# EAGLE schematic PCB_ICBExt-R1.0-J23 (EAGLE 6.6.0)
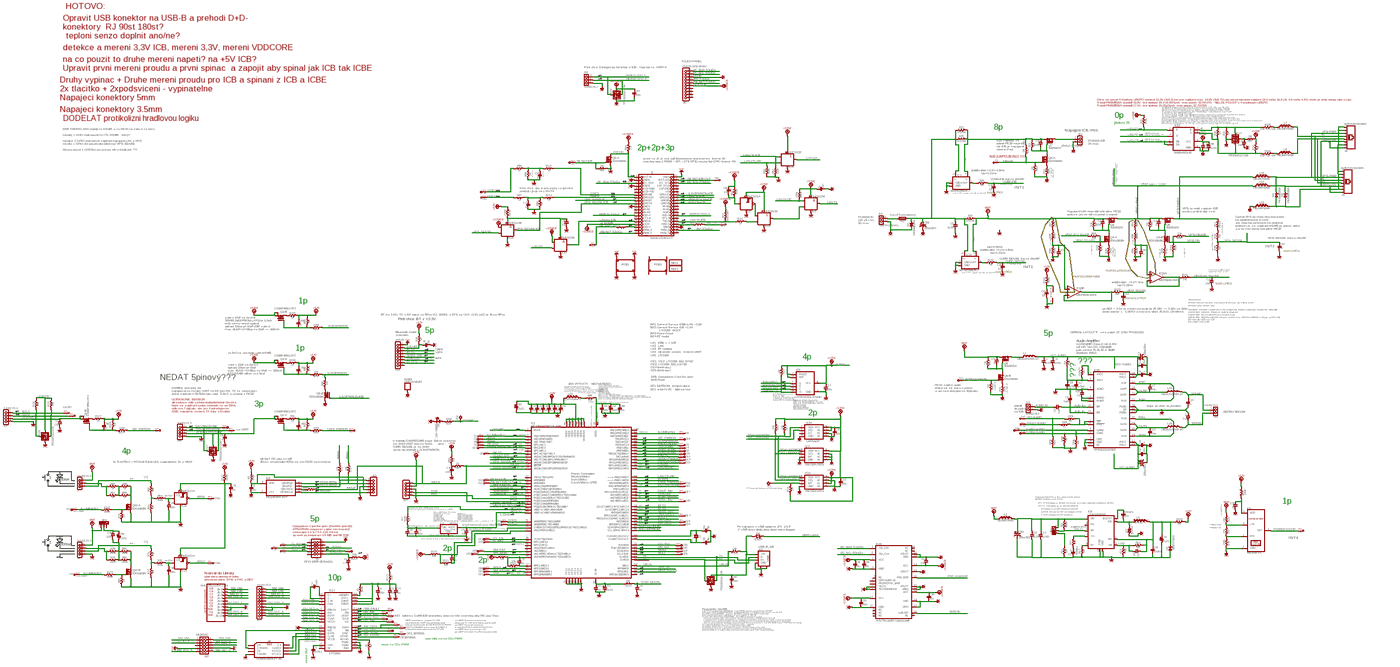
[diagram p0: schematic, sheet 1, overview]
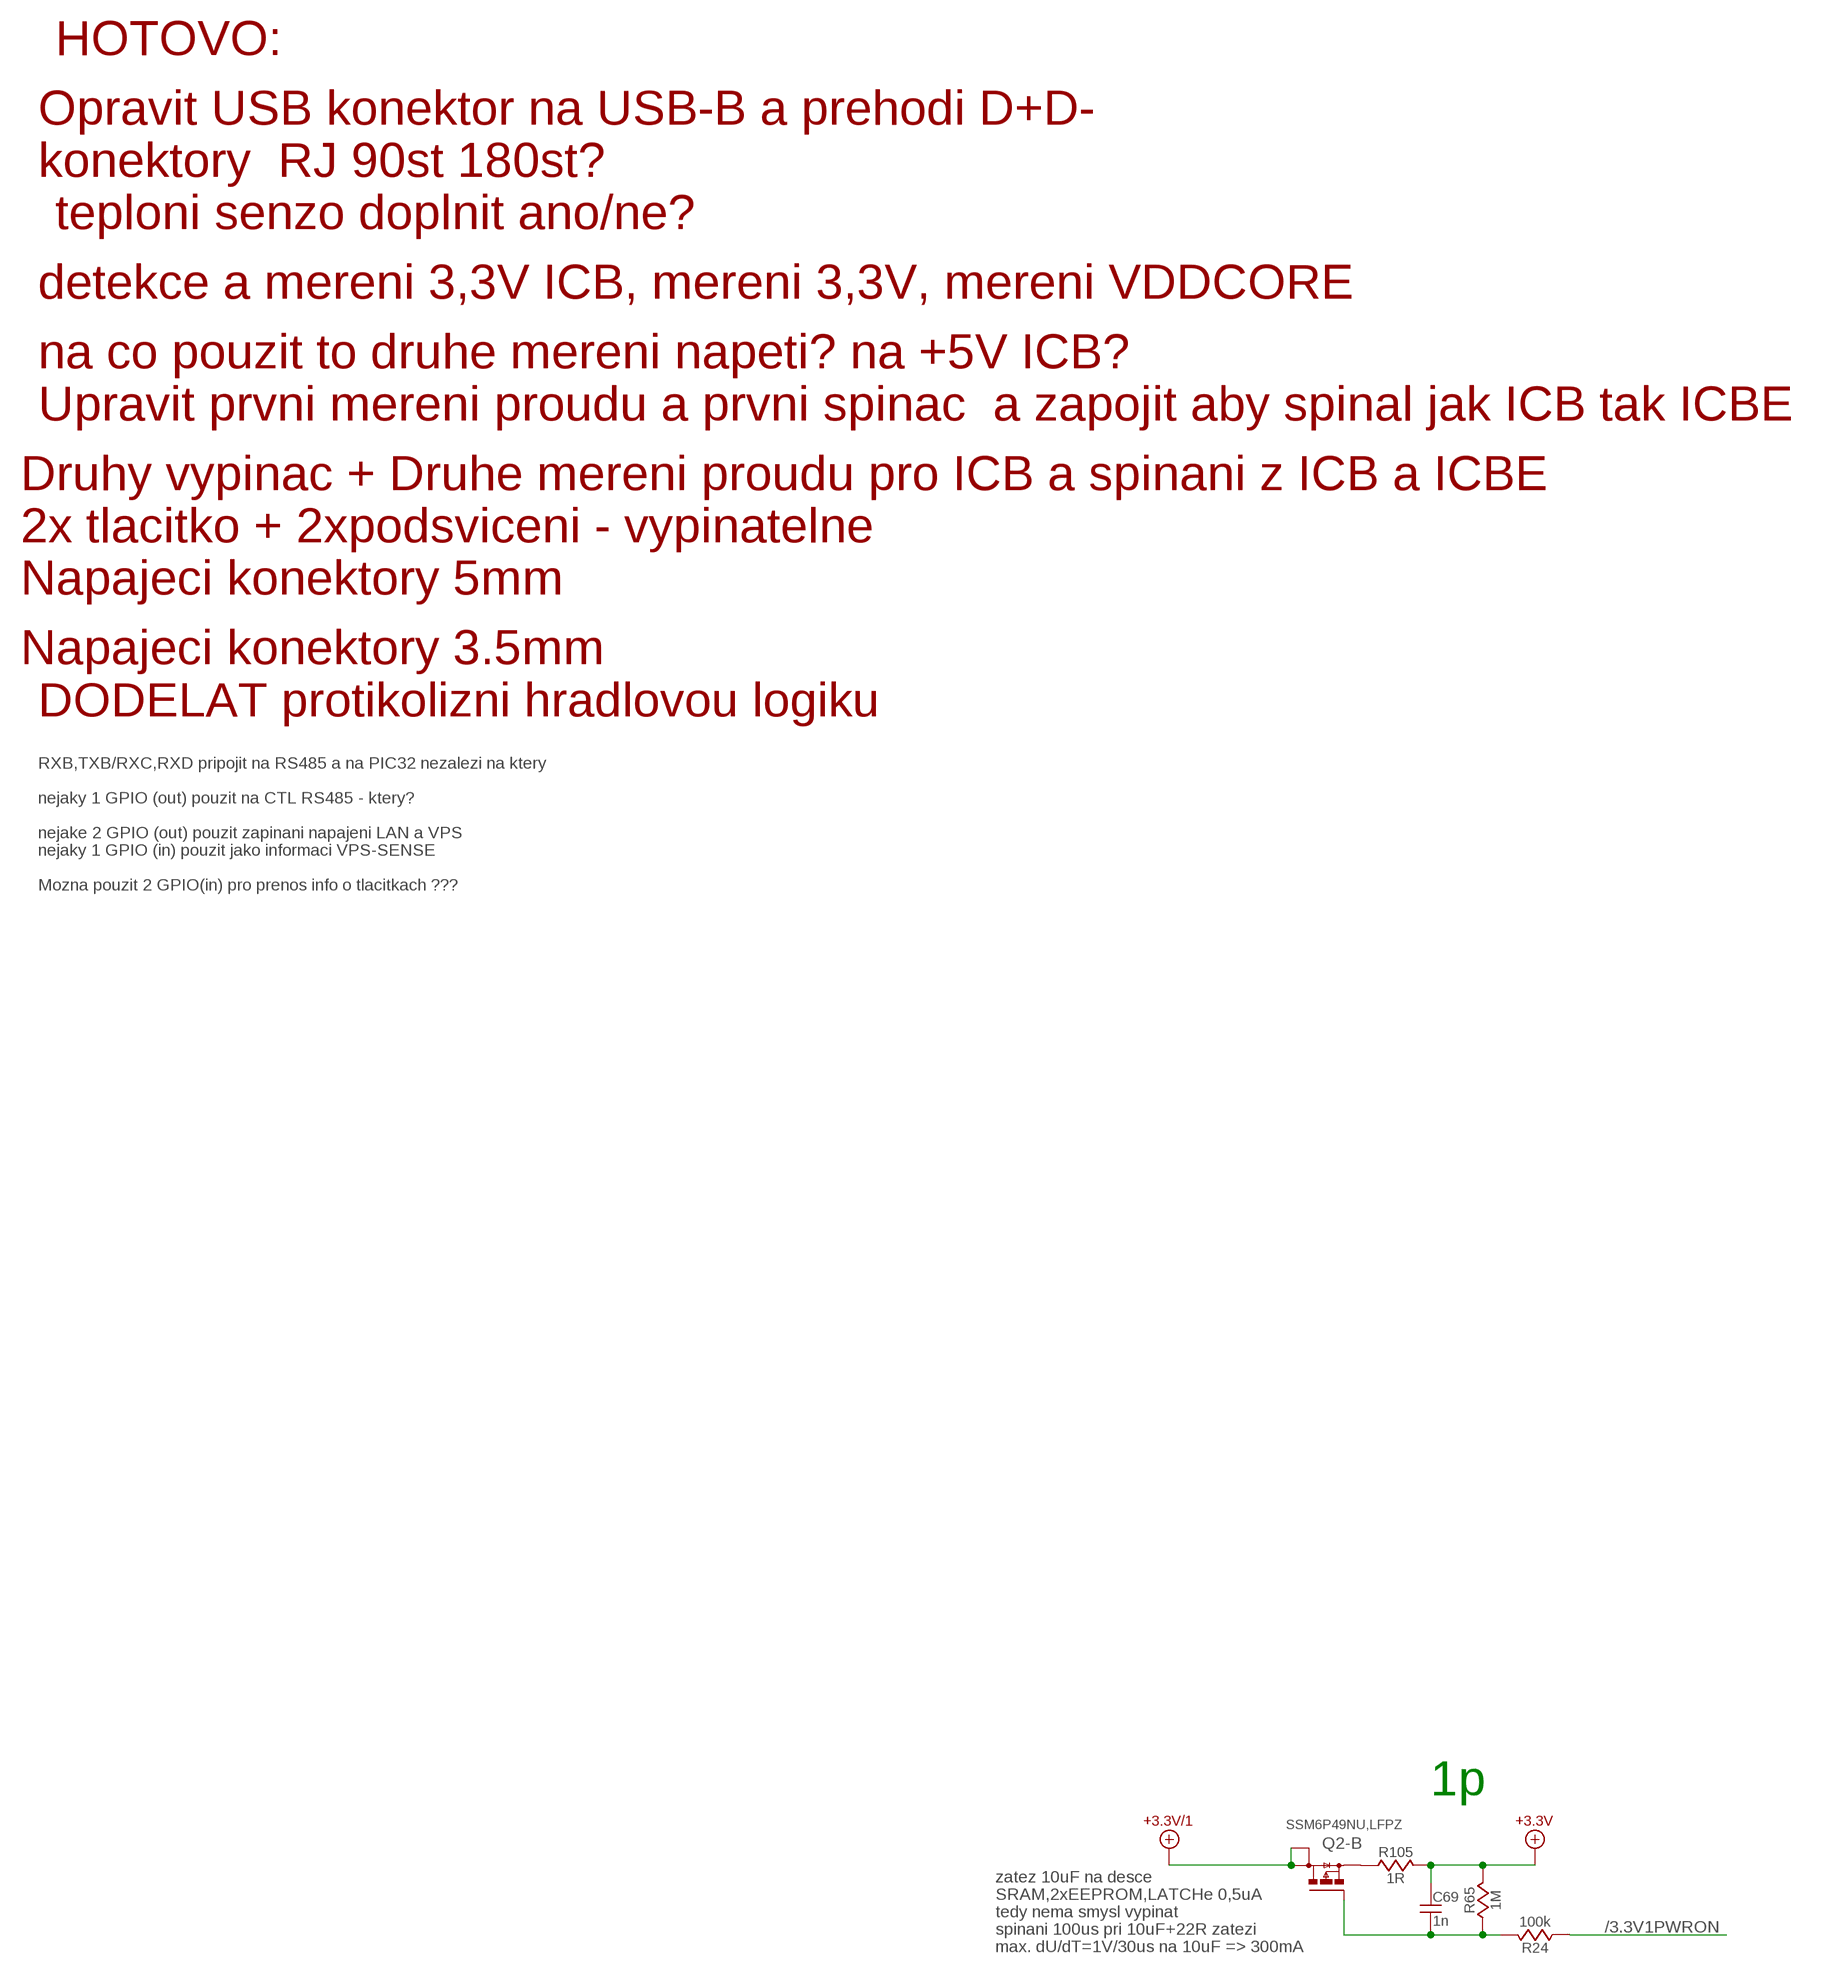
[diagram p1: schematic, sheet 1, part 1 of 6]
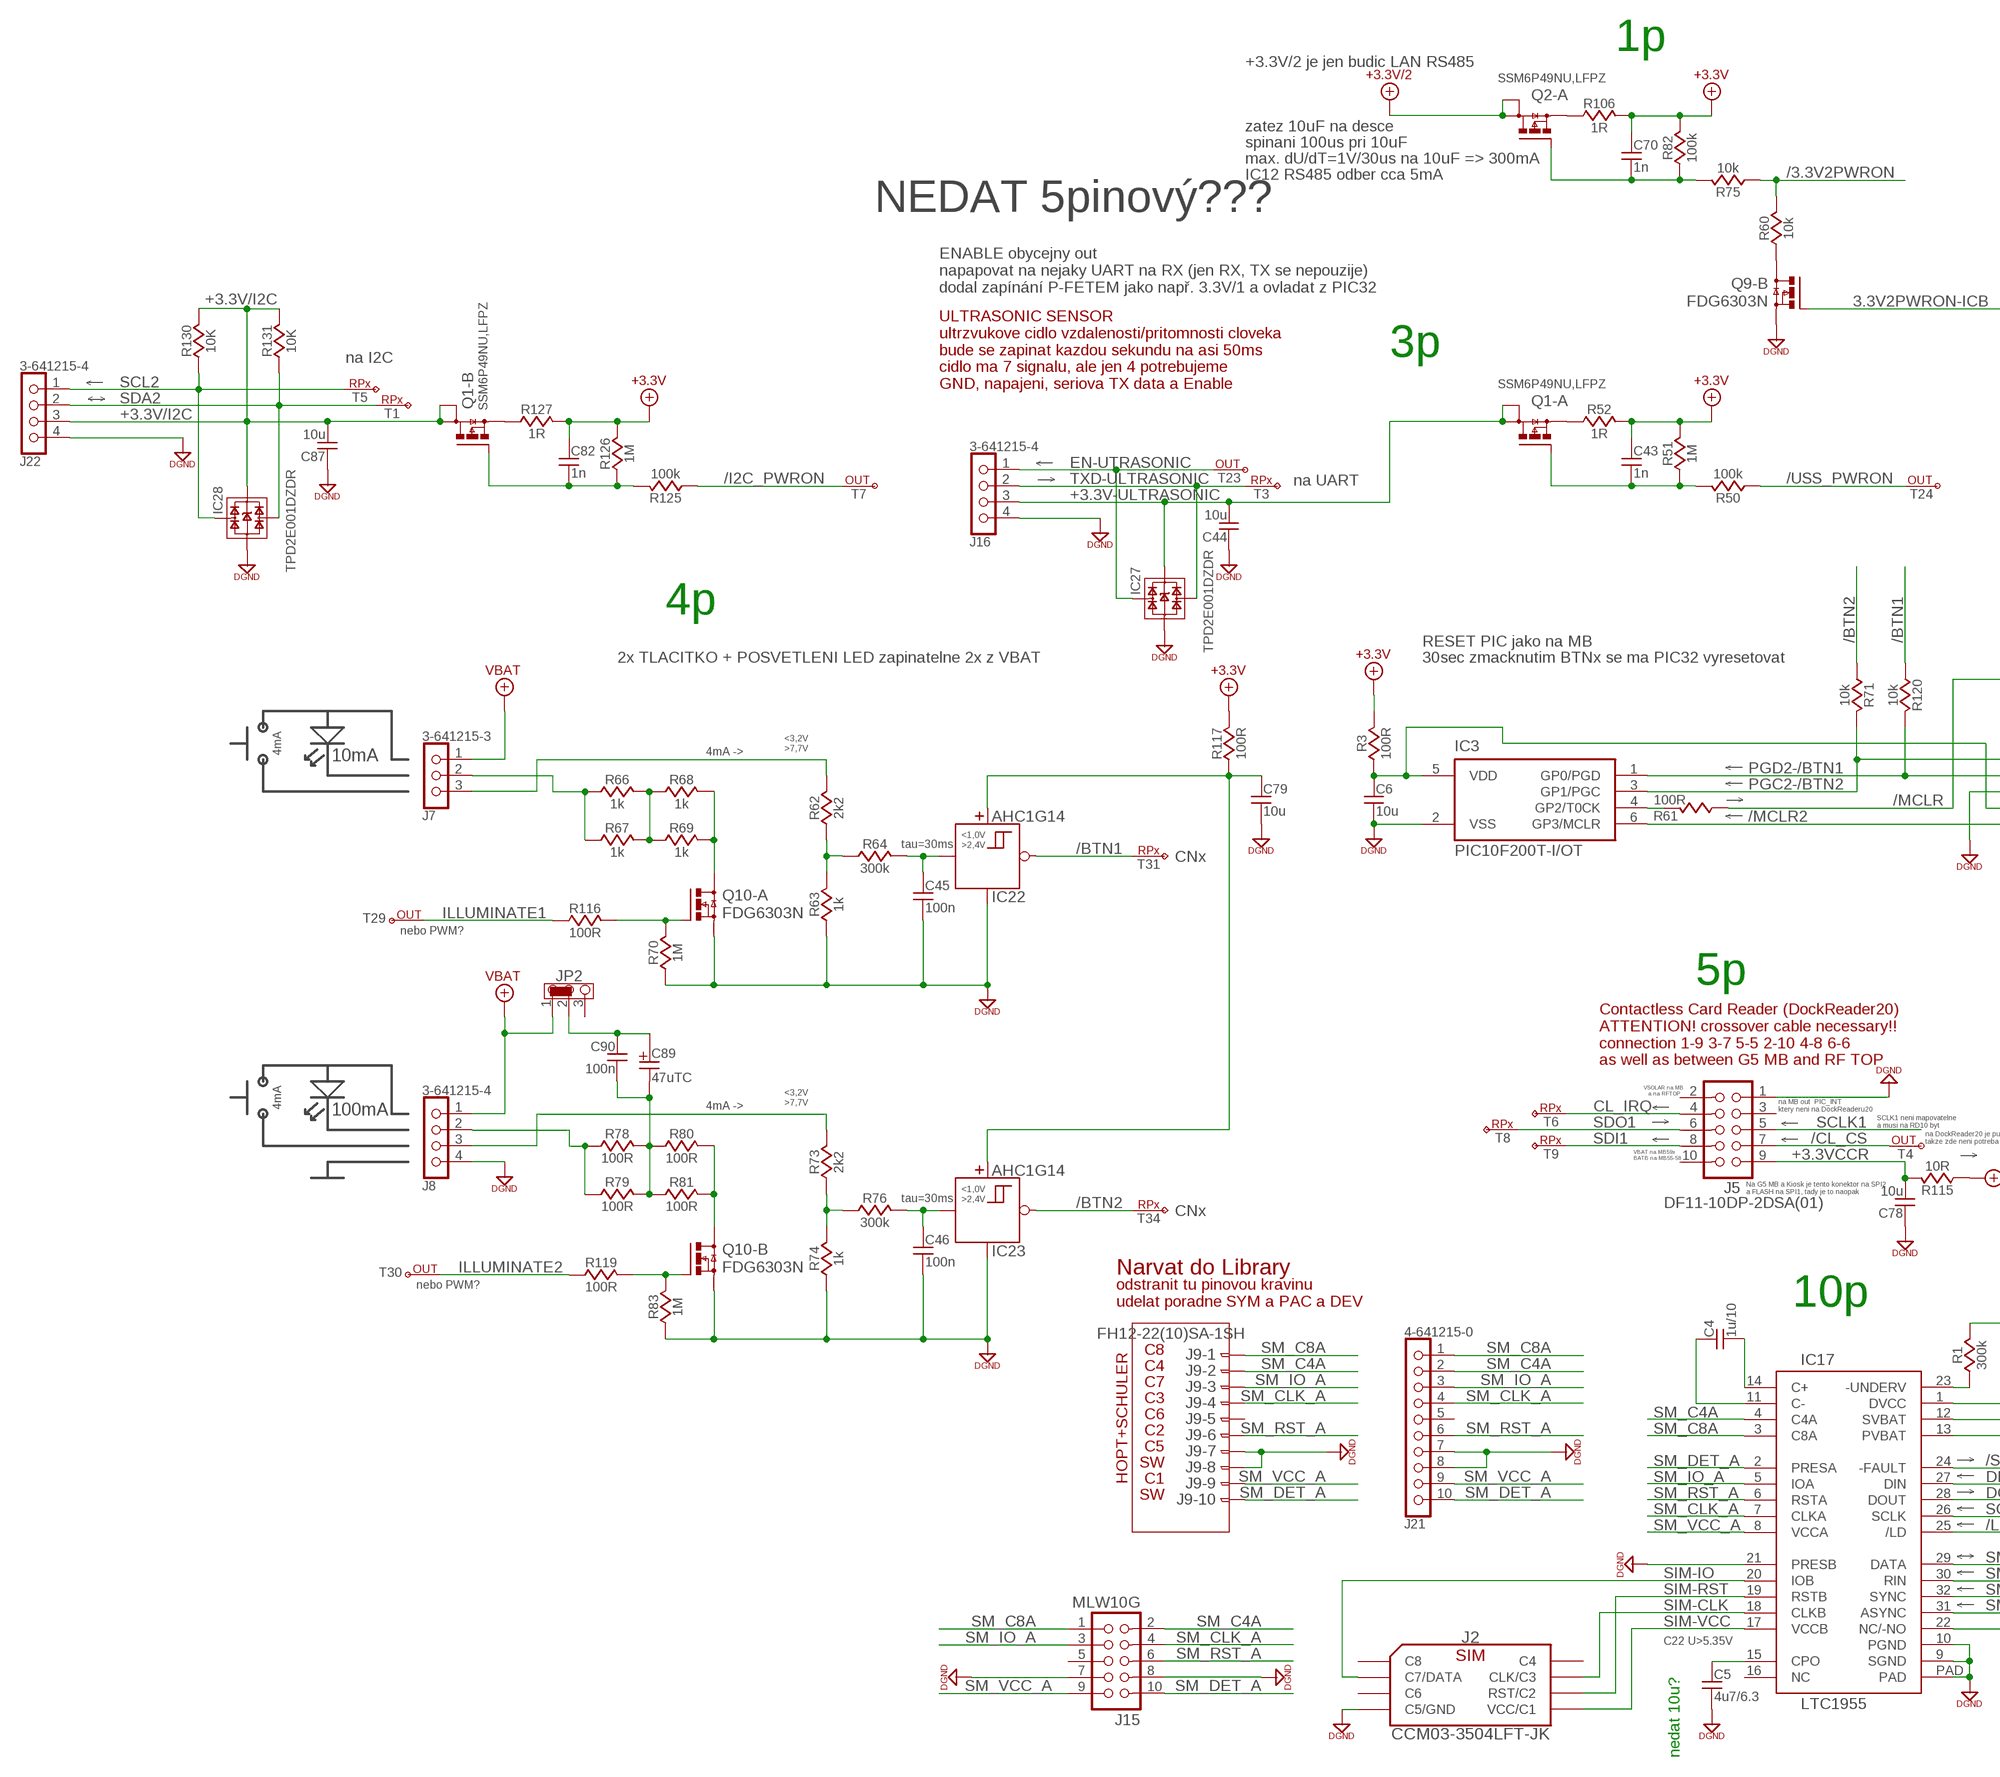
[diagram p2: schematic, sheet 1, part 2 of 6]
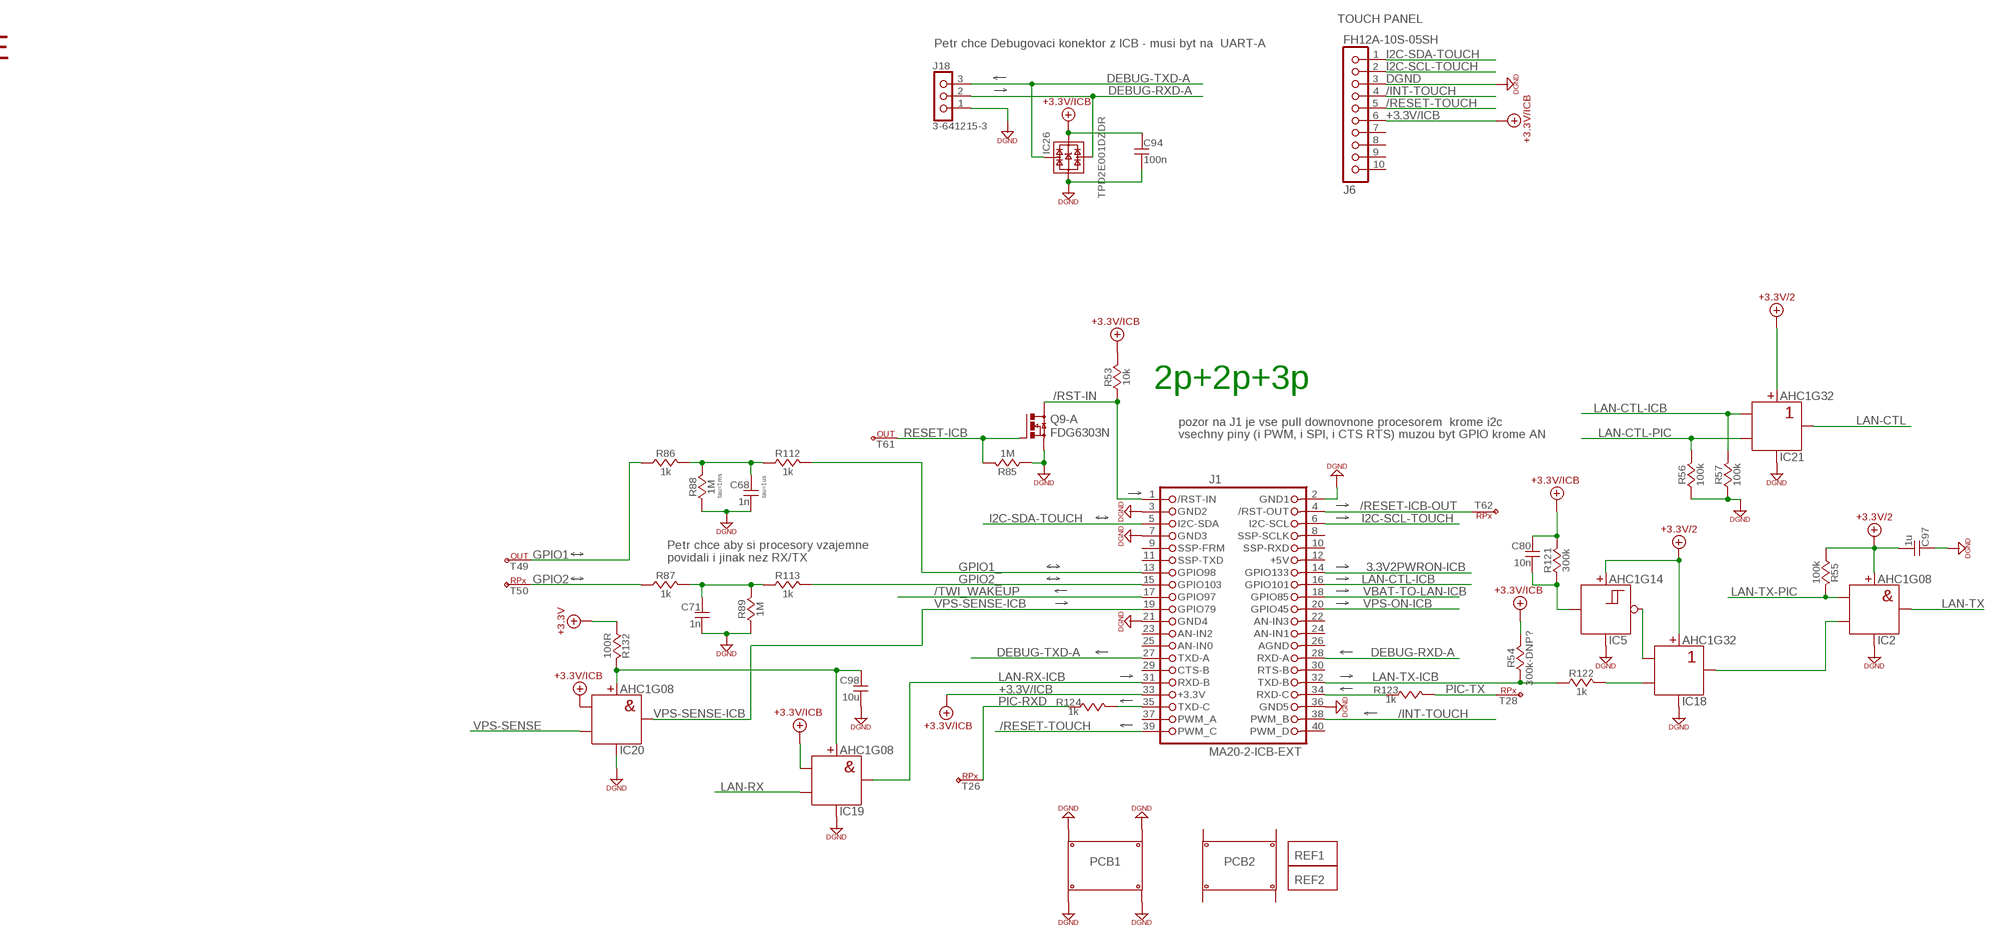
[diagram p3: schematic, sheet 1, part 3 of 6]
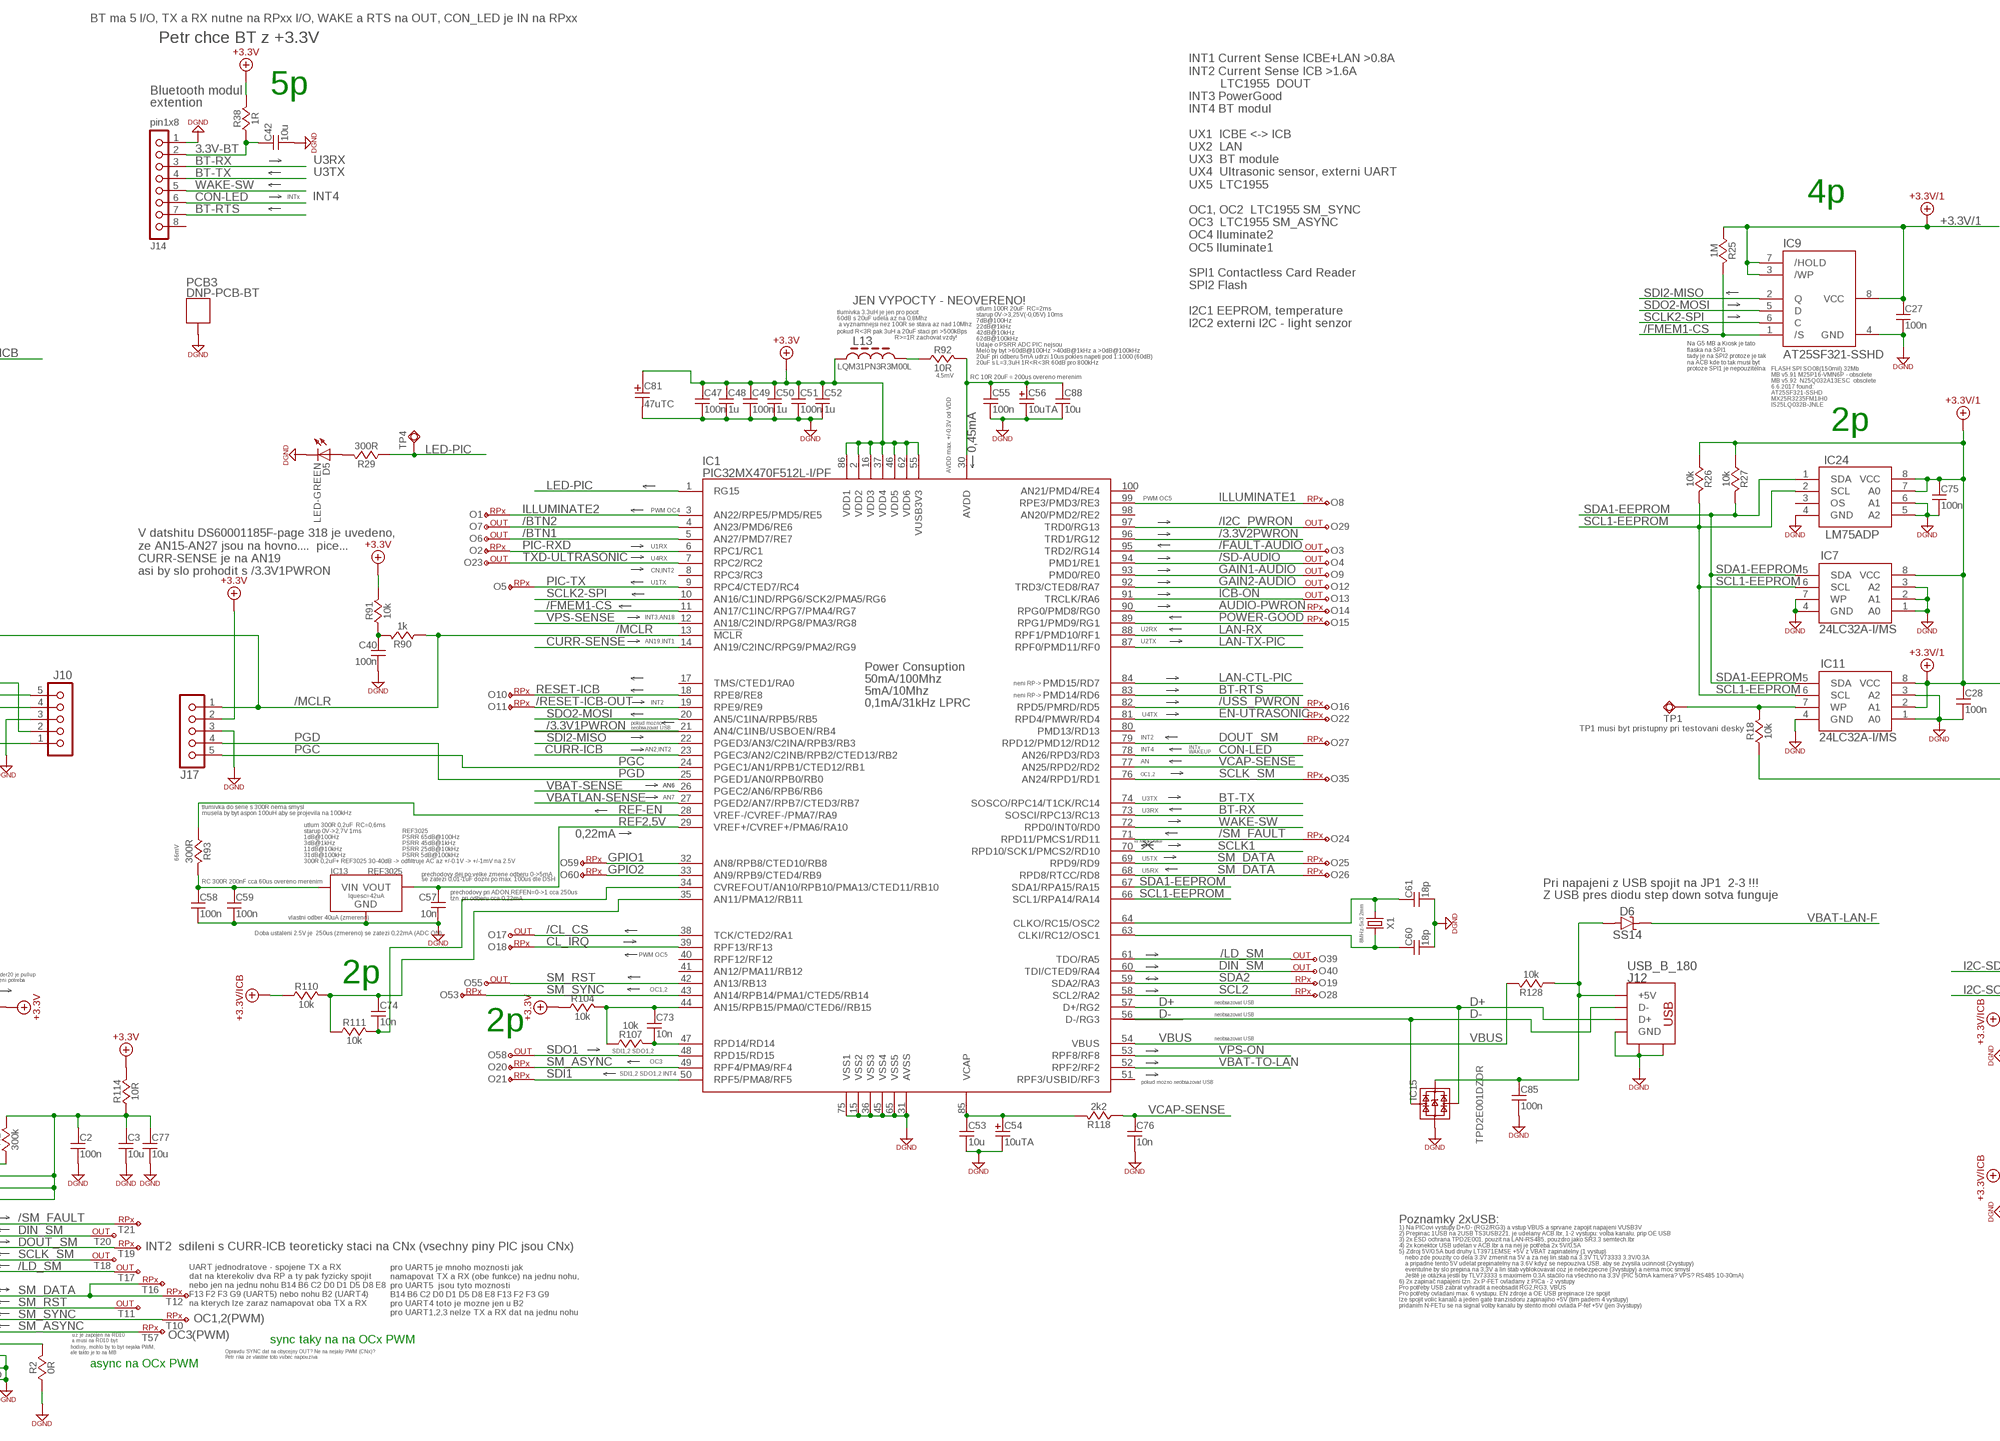
[diagram p4: schematic, sheet 1, part 4 of 6]
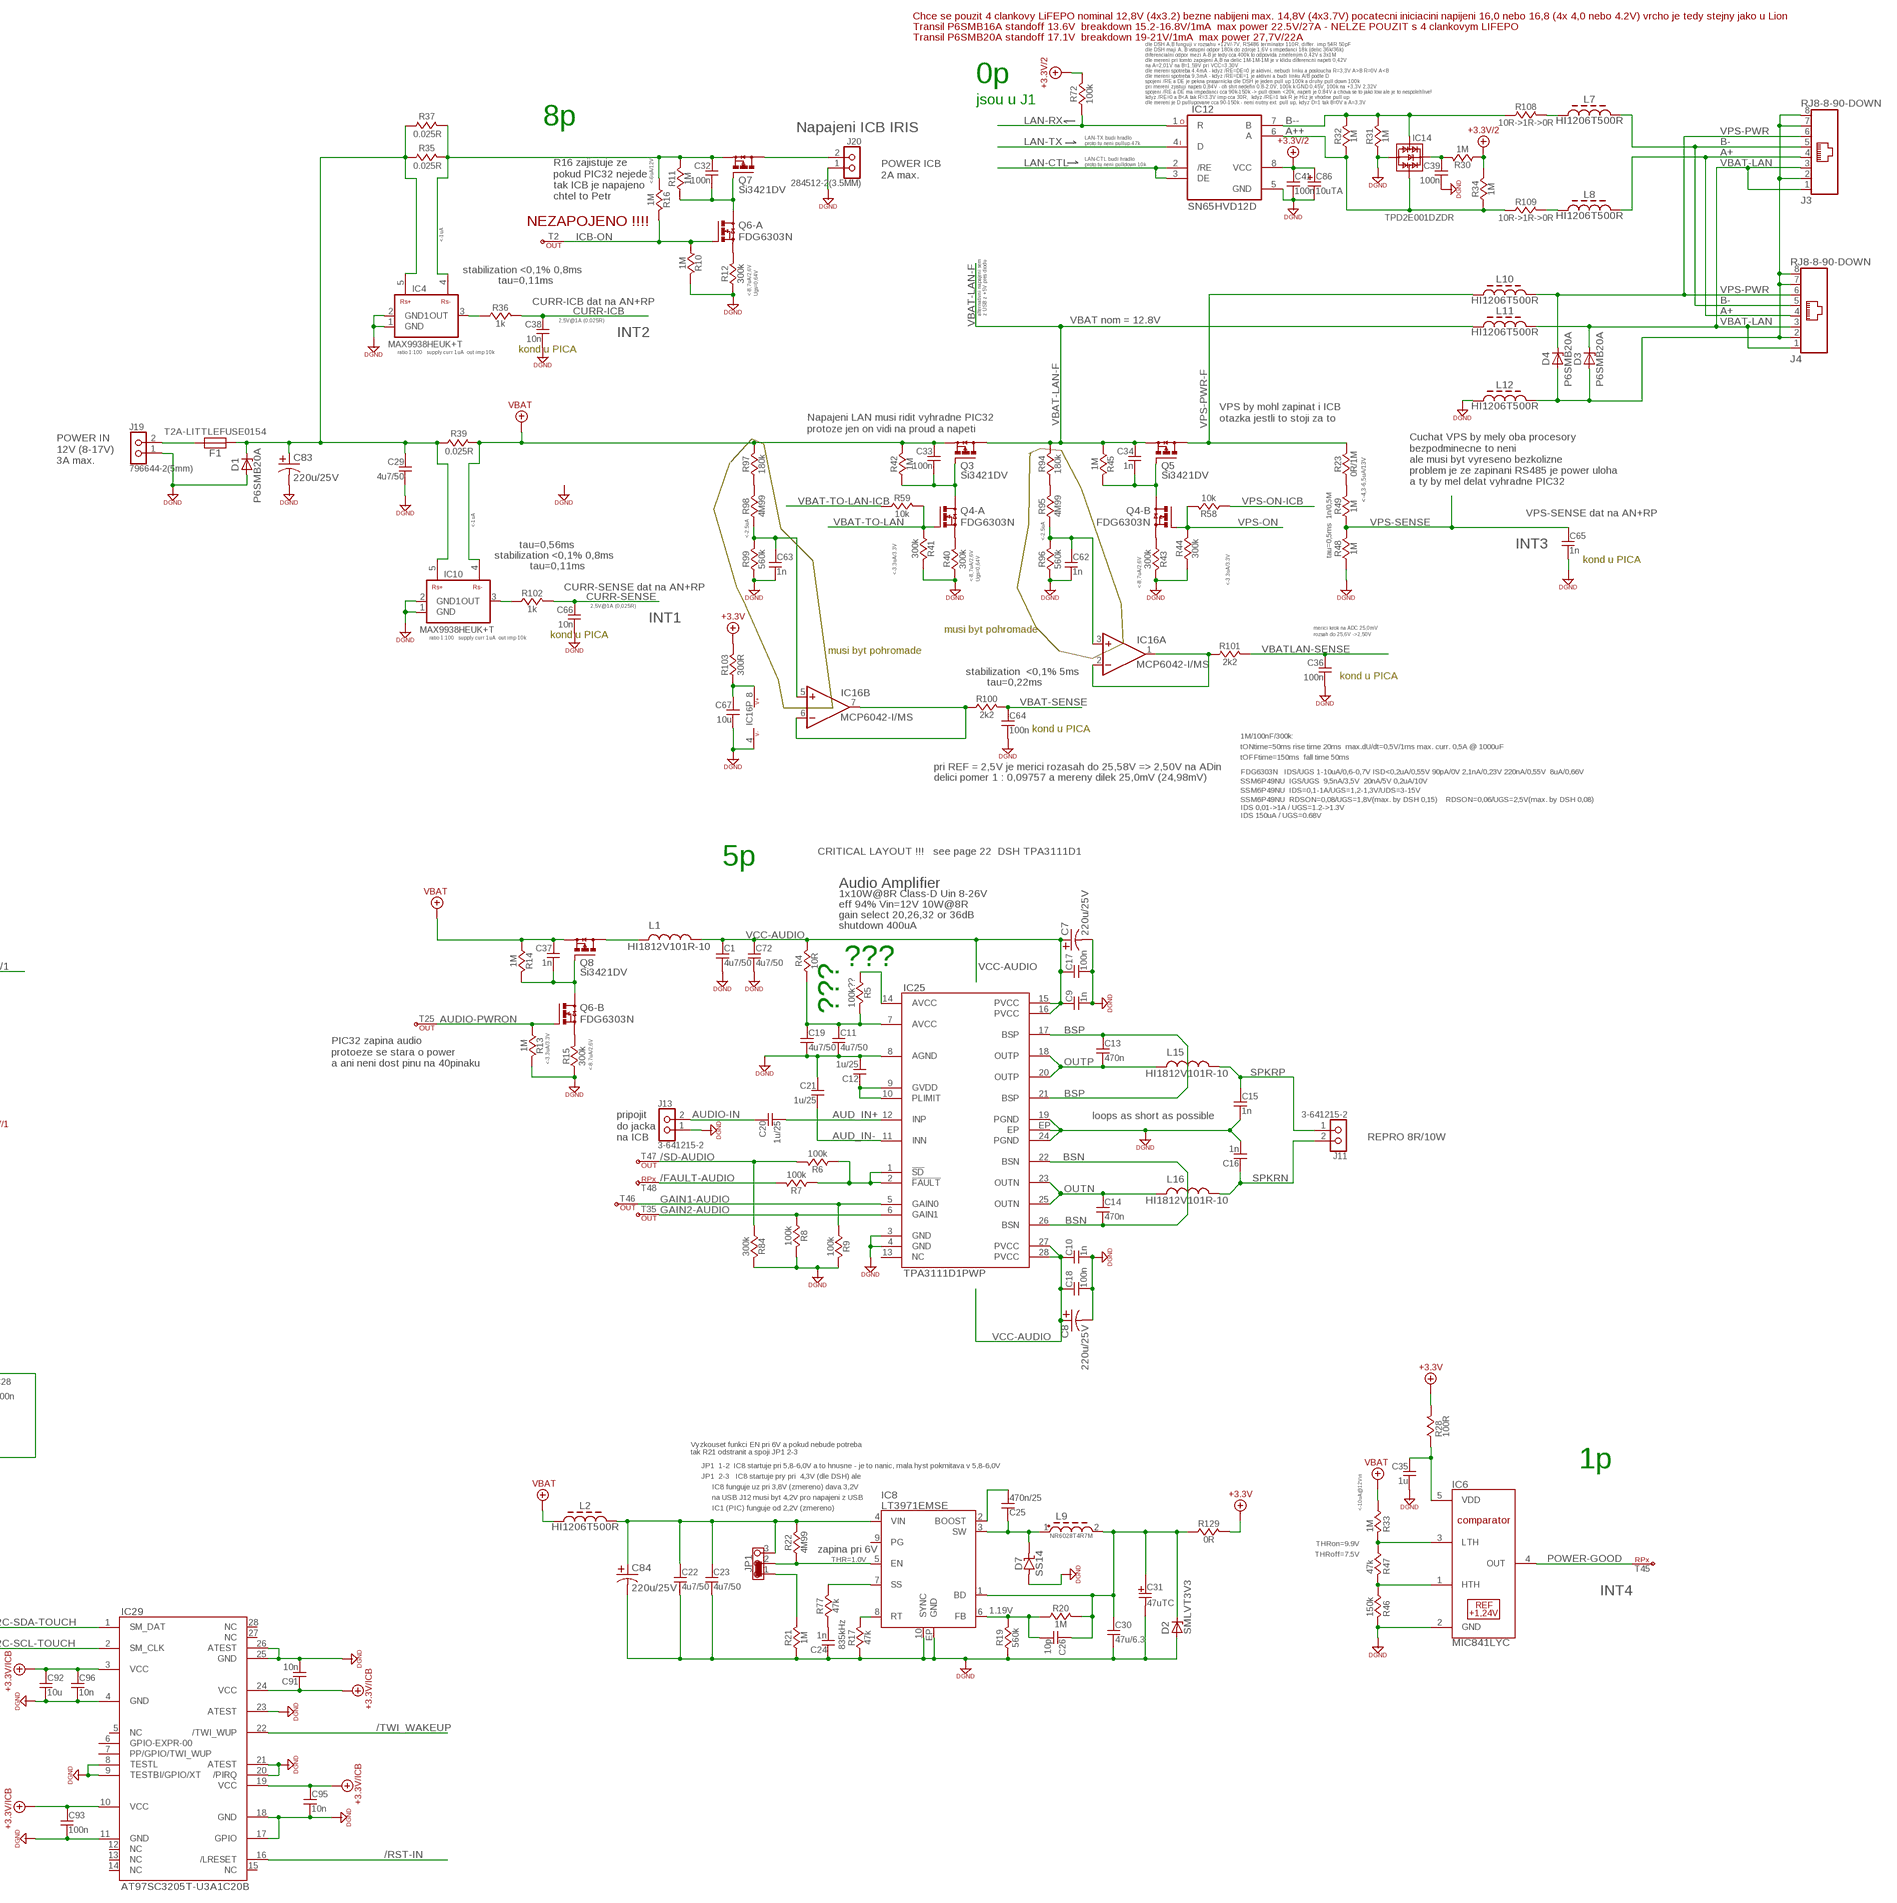
[diagram p5: schematic, sheet 1, part 5 of 6]
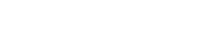
[diagram p6: schematic, sheet 1, part 6 of 6]

## Parts
C1  4u7/50  C-1206  [1206]
C2  100n  C-0603  [0603]
C3  10u  C-0603  [0603]
C4  1u/10  C-0603  [0603]
C5  4u7/6.3  C-0603  [0603]
C6  10u  C-0603  [0603]
C7  220u/25V  CAP-ELEC-SMD-8MM  [CAP_8MM_DIA_SMT]
C8  220u/25V  CAP-ELEC-SMD-8MM  [CAP_8MM_DIA_SMT]
C9  1n  C-0603  [0603]
C10  1n  C-0603  [0603]
C11  4u7/50  C-1206  [1206]
C12  1u/25  C-0603  [0603]
C13  470n  C-0603  [0603]
C14  470n  C-0603  [0603]
C15  1n  C-0603  [0603]
C16  1n  C-0603  [0603]
C17  100n  C-0603  [0603]
C18  100n  C-0603  [0603]
C19  4u7/50  C-1206  [1206]
C20  1u/25  C-0603  [0603]
C21  1u/25  C-0603  [0603]
C22  4u7/50  C-1206  [1206]
C23  4u7/50  C-1206  [1206]
C24  1n  C-0603  [0603]
C25  470n/25  C-0603  [0603]
C26  10p  C-0603  [0603]
C27  100n  C-0603  [0603]
C28  100n  C-0603  [0603]
C29  4u7/50  C-1206  [1206]
C30  47u/6.3  C-1206  [1206]
C31  47uTC  CT-C  [CT-C]
C32  100n  C-0603  [0603]
C33  100n  C-0603  [0603]
C34  1n  C-0603  [0603]
C35  1u  C-0603  [0603]
C36  100n  C-0603  [0603]
C37  1n  C-0603  [0603]
C38  10n  C-0603  [0603]
C39  100n  C-0603  [0603]
C40  100n  C-0603  [0603]
C41  100n  C-0603  [0603]
C42  10u  C-0603  [0603]
C43  1n  C-0603  [0603]
C44  10u  C-0603  [0603]
C45  100n  C-0603  [0603]
C46  100n  C-0603  [0603]
C47  100n  C-0603  [0603]
C48  1u  C-0603  [0603]
C49  100n  C-0603  [0603]
C50  1u  C-0603  [0603]
C51  100n  C-0603  [0603]
C52  1u  C-0603  [0603]
C53  10u  C-0603  [0603]
C54  10uTA  CT-1206  [1206-POL-C]
C55  100n  C-0603  [0603]
C56  10uTA  CT-1206  [1206-POL-C]
C57  10n  C-0603  [0603]
C58  100n  C-0603  [0603]
C59  100n  C-0603  [0603]
C60  18p  C-0603  [0603]
C61  18p  C-0603  [0603]
C62  1n  C-0603  [0603]
C63  1n  C-0603  [0603]
C64  100n  C-0603  [0603]
C65  1n  C-0603  [0603]
C66  10n  C-0603  [0603]
C67  10u  C-0603  [0603]
C68  1n  C-0603  [0603]
C69  1n  C-0603  [0603]
C70  1n  C-0603  [0603]
C71  1n  C-0603  [0603]
C72  4u7/50  C-1206  [1206]
C73  10n  C-0603  [0603]
C74  10n  C-0603  [0603]
C75  100n  C-0603  [0603]
C76  10n  C-0603  [0603]
C77  10u  C-0603  [0603]
C78  10u  C-0603  [0603]
C79  10u  C-0603  [0603]
C80  10n  C-0603  [0603]
C81  47uTC  CT-C  [CT-C]
C82  1n  C-0603  [0603]
C83  220u/25V  CAP-ELEC-SMD-8MM  [CAP_8MM_DIA_SMT]
C84  220u/25V  CAP-ELEC-SMD-8MM  [CAP_8MM_DIA_SMT]
C85  100n  C-0603  [0603]
C86  10uTA  CT-1206  [1206-POL-C]
C87  10u  C-0603  [0603]
C88  10u  C-0603  [0603]
C89  47uTC  CT-C  [CT-C]
C90  100n  C-0603  [0603]
C91  10n  C-0603  [0603]
C92  10u  C-0603  [0603]
C93  100n  C-0603  [0603]
C94  100n  C-0603  [0603]
C95  10n  C-0603  [0603]
C96  10n  C-0603  [0603]
C97  1u  C-0603  [0603]
C98  10u  C-0603  [0603]
D1  P6SMB20A  P6SMB  [SMB]
D2  SMLVT3V3  [SMA]
D3  P6SMB20A  P6SMB  [SMB]
D4  P6SMB20A  P6SMB  [SMB]
D5  LED-GREEN  LED-0805  [0805-POL-D]
D6  SS14  DS-SMA  [SMA]
D7  SS14  DS-SMA  [SMA]
F1  T2A-LITTLEFUSE0154  POJISTKA-LITTLEFUSE0154  [LITTLEFUSE0154]
IC1  PIC32MX470F512L-I/PF  [TQFP100_14X14_0,5MM]
IC2  AHC1G08  [SC70-5,SOT353,TSSOP5]
IC3  PIC10F200T-I/OT  [SOT23-6]
IC4  MAX9938HEUK+T  TSM9938HEUK+T  [SOT23-5]
IC5  AHC1G14  [SC70-5,SOT353,TSSOP5]
IC6  MIC841LYC  [SC-70-5]
IC7  24LC32A-I/MS  24-I/MS  [MSOP-08]
IC8  LT3971EMSE  [MSOP10EXP]
IC9  AT25SF321-SSHD  M25P16-VMN6P  [SO-08]
IC10  MAX9938HEUK+T  TSM9938HEUK+T  [SOT23-5]
IC11  24LC32A-I/MS  24-I/MS  [MSOP-08]
IC12  SN65HVD12D  SN65HVD3082ED  [SO08]
IC13  REF3025  [SOT23]
IC14  TPD2E001DZDR  SR05.TCT  [SOT-143]
IC15  TPD2E001DZDR  SR05.TCT  [SOT-143]
IC16  MCP6042-I/MS  [MSOP-08]
IC17  LTC1955  [QFN32]
IC18  AHC1G32  [SC70-5,SOT353,TSSOP5]
IC19  AHC1G08  [SC70-5,SOT353,TSSOP5]
IC20  AHC1G08  [SC70-5,SOT353,TSSOP5]
IC21  AHC1G32  [SC70-5,SOT353,TSSOP5]
IC22  AHC1G14  [SC70-5,SOT353,TSSOP5]
IC23  AHC1G14  [SC70-5,SOT353,TSSOP5]
IC24  LM75ADP  [TSSOP08-3]
IC25  TPA3111D1PWP  IC_TI_TPA3111D1PWP  [TSSOP28_EP]
IC26  TPD2E001DZDR  SR05.TCT  [SOT-143]
IC27  TPD2E001DZDR  SR05.TCT  [SOT-143]
IC28  TPD2E001DZDR  SR05.TCT  [SOT-143]
IC29  AT97SC3205T-U3A1C20B  [TSSOP28]
J1  MA20-2-ICB-EXT  [MA20-2]
J2  CCM03-3504LFT-JK  [CCM03-3504LFT-JK]
J3  RJ8-8-90-DOWN  [RJ8-8-90-DOWN]
J4  RJ8-8-90-DOWN  [RJ8-8-90-DOWN]
J5  DF11-10DP-2DSA(01)  [DF11-10DP-2DSA]
J6  FH12A-10S-05SH  [FH12A-10S-05SH]
J7  3-641215-3  [3-641215-3]
J8  3-641215-4  [3-641215-4]
J9  FH12-22(10)SA-1SH  FH12-10S-0.5S1.00MM  [CON-FPC-1.0MM-10POS]
J10  DNP-open-hole  MA05-1  [MA05-1]
J11  3-641215-2  [3-641215-2]
J12  USB_B_180  USB_B_90  [USB_B_90]
J13  3-641215-2  [3-641215-2]
J14  pin1x8  MA08-1-M  [MA08-1-MALE]
J15  MLW10G  [MLW10G-5X2]
J16  3-641215-4  [3-641215-4]
J17  DNP-open-hole  MA05-1  [MA05-1]
J18  3-641215-3  [3-641215-3]
J19  796644-2(5mm)  796644-2  [796644-2-5MM]
J20  284512-2(3.5MM)  284512-2  [284512-2-3,5MM]
J21  4-641215-0  [4-641215-0]
J22  3-641215-4  [3-641215-4]
JP1  JP3CLOSE12  [JP3CLOSE12]
JP2  JP3CLOSE12  [JP3CLOSE12]
L1  HI1812V101R-10  L1812  [L1812]
L2  HI1206T500R  L-1206  [1206]
L7  HI1206T500R  L-1206  [1206]
L8  HI1206T500R  L-1206  [1206]
L9  NR6028T4R7M  NR6028  [NR6028]
L10  HI1206T500R  L-1206  [1206]
L11  HI1206T500R  L-1206  [1206]
L12  HI1206T500R  L-1206  [1206]
L13  LQM31PN3R3M00L  L-1206  [1206]
L15  HI1812V101R-10  L1812  [L1812]
L16  HI1812V101R-10  L1812  [L1812]
O1  PIC-RPX  [TEMP-PAD]
O2  PIC-RPX  [TEMP-PAD]
O3  PIC-OUT  [TEMP-PAD]
O4  PIC-OUT  [TEMP-PAD]
O5  PIC-RPX  [TEMP-PAD]
O6  PIC-OUT  [TEMP-PAD]
O7  PIC-OUT  [TEMP-PAD]
O8  PIC-RPX  [TEMP-PAD]
O9  PIC-OUT  [TEMP-PAD]
O10  PIC-RPX  [TEMP-PAD]
O11  PIC-RPX  [TEMP-PAD]
O12  PIC-OUT  [TEMP-PAD]
O13  PIC-OUT  [TEMP-PAD]
O14  PIC-RPX  [TEMP-PAD]
O15  PIC-RPX  [TEMP-PAD]
O16  PIC-RPX  [TEMP-PAD]
O17  PIC-OUT  [TEMP-PAD]
O18  PIC-RPX  [TEMP-PAD]
O19  PIC-RPX  [TEMP-PAD]
O20  PIC-RPX  [TEMP-PAD]
O21  PIC-RPX  [TEMP-PAD]
O22  PIC-RPX  [TEMP-PAD]
O23  PIC-OUT  [TEMP-PAD]
O24  PIC-RPX  [TEMP-PAD]
O25  PIC-RPX  [TEMP-PAD]
O26  PIC-RPX  [TEMP-PAD]
O27  PIC-RPX  [TEMP-PAD]
O28  PIC-RPX  [TEMP-PAD]
O29  PIC-OUT  [TEMP-PAD]
O35  PIC-RPX  [TEMP-PAD]
O39  PIC-OUT  [TEMP-PAD]
O40  PIC-OUT  [TEMP-PAD]
O53  PIC-RPX  [TEMP-PAD]
O55  PIC-OUT  [TEMP-PAD]
O58  PIC-OUT  [TEMP-PAD]
O59  PIC-RPX  [TEMP-PAD]
O60  PIC-RPX  [TEMP-PAD]
PCB1  PCB-ICBE  [PCB-ICBE]
PCB2  NDP-PCB-ICB  PCB-ICB  [PCB-ICB]
PCB3  DNP-PCB-BT  BT_PCBBRD  [BT_MODULE_BRD]
Q1  SSM6P49NU,LFPZ  [MICRO_FET]
Q2  SSM6P49NU,LFPZ  [MICRO_FET]
Q3  Si3421DV  FDC658AP  [SSOT-6]
Q4  FDG6303N  [SC70-6]
Q5  Si3421DV  FDC658AP  [SSOT-6]
Q6  FDG6303N  [SC70-6]
Q7  Si3421DV  FDC658AP  [SSOT-6]
Q8  Si3421DV  FDC658AP  [SSOT-6]
Q9  FDG6303N  [SC70-6]
Q10  FDG6303N  [SC70-6]
R1  300k  R-0603  [0603]
R2  0R  R-0603  [0603]
R3  100R  R-0603  [0603]
R4  10R  R-0603  [0603]
R5  100k??  R-0603  [0603]
R6  100k  R-0603  [0603]
R7  100k  R-0603  [0603]
R8  100k  R-0603  [0603]
R9  100k  R-0603  [0603]
R10  1M  R-0603  [0603]
R11  1M  R-0603  [0603]
R12  300k  R-0603  [0603]
R13  1M  R-0603  [0603]
R14  1M  R-0603  [0603]
R15  300k  R-0603  [0603]
R16  1M  R-0603  [0603]
R17  47k  R-0603  [0603]
R18  10k  R-0603  [0603]
R19  560k  R-0603  [0603]
R20  1M  R-0603  [0603]
R21  1M  R-0603  [0603]
R22  4M99  R-0603  [0603]
R23  0R/1M  R-0603  [0603]
R24  100k  R-0603  [0603]
R25  1M  R-0603  [0603]
R26  10k  R-0603  [0603]
R27  10k  R-0603  [0603]
R28  100R  R-0603  [0603]
R29  300R  R-0603  [0603]
R30  1M  R-0603  [0603]
R31  1M  R-0603  [0603]
R32  1M  R-0603  [0603]
R33  1M  R-0603  [0603]
R34  1M  R-0603  [0603]
R35  0.025R  R-0805  [0805]
R36  1k  R-0603  [0603]
R37  0.025R  R-0805  [0805]
R38  1R  R-0805  [0805]
R39  0.025R  R-0805  [0805]
R40  300k  R-0603  [0603]
R41  300k  R-0603  [0603]
R42  1M  R-0603  [0603]
R43  300k  R-0603  [0603]
R44  300k  R-0603  [0603]
R45  1M  R-0603  [0603]
R46  150k  R-0603  [0603]
R47  47k  R-0603  [0603]
R48  1M  R-0603  [0603]
R49  1M  R-0603  [0603]
R50  100k  R-0603  [0603]
R51  1M  R-0603  [0603]
R52  1R  R-0805  [0805]
R53  10k  R-0603  [0603]
R54  300k-DNP?  R-0603  [0603]
R55  100k  R-0603  [0603]
R56  100k  R-0603  [0603]
R57  100k  R-0603  [0603]
R58  10k  R-0603  [0603]
R59  10k  R-0603  [0603]
R60  10k  R-0603  [0603]
R61  100R  R-0603  [0603]
R62  2k2  R-0603  [0603]
R63  1k  R-0603  [0603]
R64  300k  R-0603  [0603]
R65  1M  R-0603  [0603]
R66  1k  R-0603  [0603]
R67  1k  R-0603  [0603]
R68  1k  R-0603  [0603]
R69  1k  R-0603  [0603]
R70  1M  R-0603  [0603]
R71  10k  R-0603  [0603]
R72  100k  R-0603  [0603]
R73  2k2  R-0603  [0603]
R74  1k  R-0603  [0603]
R75  10k  R-0603  [0603]
R76  300k  R-0603  [0603]
R77  47k  R-0603  [0603]
R78  100R  R-0603  [0603]
R79  100R  R-0603  [0603]
R80  100R  R-0603  [0603]
R81  100R  R-0603  [0603]
R82  100k  R-0603  [0603]
R83  1M  R-0603  [0603]
R84  300k  R-0603  [0603]
R85  1M  R-0603  [0603]
R86  1k  R-0603  [0603]
R87  1k  R-0603  [0603]
R88  1M  R-0603  [0603]
R89  1M  R-0603  [0603]
R90  1k  R-0603  [0603]
R91  10k  R-0603  [0603]
R92  10R  R-0603  [0603]
R93  300R  R-0603  [0603]
R94  180k  R-0603  [0603]
R95  4M99  R-0603  [0603]
R96  560k  R-0603  [0603]
R97  180k  R-0603  [0603]
R98  4M99  R-0603  [0603]
R99  560k  R-0603  [0603]
R100  2k2  R-0603  [0603]
R101  2k2  R-0603  [0603]
R102  1k  R-0603  [0603]
R103  300R  R-0603  [0603]
R104  10k  R-0603  [0603]
R105  1R  R-0805  [0805]
R106  1R  R-0805  [0805]
R107  10k  R-0603  [0603]
R108  10R->1R->0R  R-0603  [0603]
R109  10R->1R->0R  R-0603  [0603]
R110  10k  R-0603  [0603]
R111  10k  R-0603  [0603]
R112  1k  R-0603  [0603]
R113  1k  R-0603  [0603]
R114  10R  R-0603  [0603]
R115  10R  R-0603  [0603]
R116  100R  R-0603  [0603]
R117  100R  R-0603  [0603]
R118  2k2  R-0603  [0603]
R119  100R  R-0603  [0603]
R120  10k  R-0603  [0603]
R121  300k  R-0603  [0603]
R122  1k  R-0603  [0603]
R123  1k  R-0603  [0603]
R124  1k  R-0603  [0603]
R125  100k  R-0603  [0603]
R126  1M  R-0603  [0603]
R127  1R  R-0805  [0805]
R128  10k  R-0603  [0603]
R129  0R  R-0603  [0603]
R130  10K  R-0603  [0603]
R131  10K  R-0603  [0603]
R132  100R  R-0603  [0603]
REF1  REF  [REF]
REF2  REF  [REF]
T1  PIC-RPX  [TEMP-PAD]
T2  PIC-OUT  [TEMP-PAD]
T3  PIC-RPX  [TEMP-PAD]
T4  PIC-OUT  [TEMP-PAD]
T5  PIC-RPX  [TEMP-PAD]
T6  PIC-RPX  [TEMP-PAD]
T7  PIC-OUT  [TEMP-PAD]
T8  PIC-RPX  [TEMP-PAD]
T9  PIC-RPX  [TEMP-PAD]
T10  PIC-RPX  [TEMP-PAD]
T11  PIC-OUT  [TEMP-PAD]
T12  PIC-RPX  [TEMP-PAD]
T16  PIC-RPX  [TEMP-PAD]
T17  PIC-OUT  [TEMP-PAD]
T18  PIC-OUT  [TEMP-PAD]
T19  PIC-RPX  [TEMP-PAD]
T20  PIC-OUT  [TEMP-PAD]
T21  PIC-RPX  [TEMP-PAD]
T23  PIC-OUT  [TEMP-PAD]
T24  PIC-OUT  [TEMP-PAD]
T25  PIC-OUT  [TEMP-PAD]
T26  PIC-RPX  [TEMP-PAD]
T28  PIC-RPX  [TEMP-PAD]
T29  PIC-OUT  [TEMP-PAD]
T30  PIC-OUT  [TEMP-PAD]
T31  PIC-RPX  [TEMP-PAD]
T34  PIC-RPX  [TEMP-PAD]
T35  PIC-OUT  [TEMP-PAD]
T45  PIC-RPX  [TEMP-PAD]
T46  PIC-OUT  [TEMP-PAD]
T47  PIC-OUT  [TEMP-PAD]
T48  PIC-RPX  [TEMP-PAD]
T49  PIC-OUT  [TEMP-PAD]
T50  PIC-RPX  [TEMP-PAD]
T57  PIC-RPX  [TEMP-PAD]
T61  PIC-OUT  [TEMP-PAD]
T62  PIC-RPX  [TEMP-PAD]
TP1  DNP-TestPoint  ROUND_SMD1MM  [SMD_ROUND_1MM]
TP4  DNP-TestPoint  ROUND_SMDTH1.4MM  [TH_ROUND_14MM08MM]
X1  8MHz-5x3.2mm  XTAL-7B  [7B]

## Nets
3.3V2PWRON-ICB: J1.14(GPIO133) Q9.5(-B:G)
3.3V-BT: C42.1 J14.2 R38.1
+3,3V-FILT: C35.1 IC6.5(VDD) R28.1
+3.3V: C43.1 C47.1 C48.1 C49.1 C50.1 C51.1 C52.1 C69.1 C70.1 C81.+ C82.1 IC1.2(VDD2) IC1.16(VDD3) IC1.37(VDD4) IC1.46(VDD5) IC1.55(VUSB3V3) IC1.62(VDD6) IC1.86(VDD1) J17.2 L13.1 R3.1 R28.2 R38.2 R51.1 R52.2 R65.1 R82.1 R91.2 R103.2 R104.1 R105.2 R106.2 R114.1 R115.2 R117.2 R126.1 R127.2 R129.1 R132.1
+3.3V-ULTRASONIC: C44.2 IC27.4 J16.3 Q1.6(-A:D) Q1.P1(-A:D1)
+3.3V/1: C27.1 C28.1 C75.1 IC7.8(VCC) IC9.3(/WP) IC9.7(/HOLD) IC9.8(VCC) IC11.2(A1) IC11.8(VCC) IC24.7(A0) IC24.8(VCC) Q2.3(-B:D) Q2.P2(-B:D1) R18.1 R25.2 R26.1 R27.1
+3.3V/2: C41.1 C86.+ C97.2 IC2.5(VCC) IC5.5(VCC) IC12.8(VCC) IC18.5(VCC) IC21.5(VCC) Q2.6(-A:D) Q2.P1(-A:D1) R30.2 R34.1 R55.1 R72.1
+3.3V/I2C: C87.2 IC28.4 J22.3 Q1.3(-B:D) Q1.P2(-B:D1) R130.1 R131.1
+3.3V/ICB: C80.1 C91.1 C92.1 C93.1 C94.1 C95.1 C96.1 IC19.1(A) IC20.1(A) IC26.4 IC29.3(VCC) IC29.10(VCC) IC29.19(VCC) IC29.24(VCC) J1.33(+3.3V) J6.6 R53.2 R54.2 R110.1 R121.2
+3.3VCCR: C78.2 J5.9 R115.1
/3.3V1PWRON: IC1.21(AN4/C1INB/USBOEN/RB4) R24.2
/3.3V2PWRON: IC1.96(TRD1/RG12) R60.2 R75.2
/BTN1: IC1.5(AN27/PMD7/RE7) IC22.4(OUT) O6.P$1(TP) R120.2 T31.P$1(TP)
/BTN2: IC1.4(AN23/PMD6/RE6) IC23.4(OUT) O7.P$1(TP) R71.2 T34.P$1(TP)
/CL_CS: IC1.38(TCK/CTED2/RA1) J5.7 O17.P$1(TP) T4.P$1(TP)
/FAULT-AUDIO: IC1.95(TRD2/RG14) O3.P$1(TP) R7.1 T48.P$1(TP)
/FMEM1-CS: IC1.11(AN17/C1INC/RPG7/PMA4/RG7) IC9.1(/S) R25.1
/I2C_PWRON: IC1.97(TRD0/RG13) O29.P$1(TP) R125.2 T7.P$1(TP)
/INT-TOUCH: J1.38(PWM_B) J6.4
/LD_SM: IC1.61(TDO/RA5) IC17.25(/LD) O39.P$1(TP) T17.P$1(TP)
/MCLR: IC1.13(!MCLR) J17.1 R61.2 R90.2
/MCLR2: IC3.6(GP3/MCLR) J10.1
/RESET-ICB-OUT: IC1.19(RPE9/RE9) J1.4(/RST-OUT) O11.P$1(TP) T62.P$1(TP)
/RESET-TOUCH: J1.39(PWM_C) J6.5
/RST-IN: IC29.16(/LRESET) J1.1(/RST-IN) Q9.6(-A:D) R53.1
/SD-AUDIO: IC1.94(PMD1/RE1) O4.P$1(TP) R6.1 R84.2 T47.P$1(TP)
/SM_FAULT: IC1.71(RPD11/PMCS1/RD11) IC17.24(-FAULT) O24.P$1(TP) T21.P$1(TP)
/TWI_WAKEUP: IC29.22(/TWI_WUP) J1.17(GPIO97)
/USS_PWRON: IC1.82(RPD5/PMRD/RD5) O16.P$1(TP) R50.2 T24.P$1(TP)
A+ [HV]: J3.4 J4.4 L8.2
A++ [HV]: IC12.6(A) IC14.3 R32.2 R34.2 R109.2
AUD-AVCC: C11.1 C19.1 IC25.7(AVCC) R4.2 R5.1
AUD_AMP_FAULT#: IC25.1(!SD) IC25.2(!FAULT) R6.2 R7.2
AUD_GVDD: C12.1 IC25.9(GVDD) IC25.10(PLIMIT)
AUD_IN+: C20.2 IC25.12(INP)
AUD_IN-: C21.2 IC25.11(INN)
AUDIO-IN: C20.1 J13.2
AUDIO-PWRON: IC1.90(RPG0/PMD8/RG0) O14.P$1(TP) Q6.5(-B:G) R13.1 T25.P$1(TP)
AVDD: C55.1 C56.+ C88.1 IC1.30(AVDD) R92.2
B- [HV]: J3.5 J4.5 L7.2
B-- [HV]: IC12.7(B) IC14.2 R31.1 R32.1 R108.2
BSN: C14.2 IC25.22(BSN) IC25.26(BSN)
BSP: C13.1 IC25.17(BSP) IC25.21(BSP)
BT-RTS: IC1.83(PMD14/RD6) J14.7
BT-RX: IC1.73(SOSCI/RPC13/RC13) J14.3
BT-TX: IC1.74(SOSCO/RPC14/T1CK/RC14) J14.4
CL_IRQ: IC1.39(RPF13/RF13) J5.4 O18.P$1(TP) T6.P$1(TP)
CON-LED: IC1.78(AN26/RPD3/RD3) J14.6
CURR-ICB: C38.1 IC1.23(PGEC3/AN2/C2INB/RPB2/CTED13/RB2) R36.2
CURR-SENSE: C66.1 IC1.14(AN19/C2INC/RPG9/PMA2/RG9) R102.2
D+: IC1.57(D+/RG2) IC15.3 J12.3_D+(D+)
D-: IC1.56(D-/RG3) IC15.2 J12.2_D-(D-)
DEBUG-RXD-A: IC26.3 J1.28(RXD-A) J18.2
DEBUG-TXD-A: IC26.2 J1.27(TXD-A) J18.3
DGND [GND]: C1.2 C2.2 C3.2 C5.2 C6.2 C7.2 C8.2 C9.2 C10.2 C11.2 C12.2 C15.2 C16.2 C17.2 C18.2 C19.2 C21.1 C22.2 C23.2 C24.1 C27.2 C28.2 C29.2 C30.2 C31.- C35.2 C36.2 C38.2 C39.2 C40.2 C41.2 C42.2 C44.1 C45.2 C46.2 C47.2 C48.2 C49.2 C50.2 C51.2 C52.2 C53.2 C54.- C55.2 C56.- C57.2 C58.2 C59.2 C60.2 C61.2 C62.2 C63.2 C64.2 C65.2 C66.2 C67.2 C68.2 C71.2 C72.2 C75.2 C76.2 C77.2 C78.1 C79.2 C81.- C83.2 C84.2 C85.2 C86.- C87.1 C88.2 C91.2 C92.2 C93.2 C94.2 C95.2 C96.2 C97.1 C98.2 D1.A D2.-(A) D5.K D7.A IC1.15(VSS2) IC1.31(AVSS) IC1.36(VSS3) IC1.45(VSS4) IC1.65(VSS5) IC1.75(VSS1) IC2.3(GND) IC3.2(VSS) IC4.1(GND) IC4.2(GND1) IC5.3(GND) IC6.2(GND) IC7.1(A0) IC7.2(A1) IC7.3(A2) IC7.4(GND) IC7.7(WP) IC8.10(SYNC) IC8.EP(GND) IC9.4(GND) IC10.1(GND) IC10.2(GND1) IC11.1(A0) IC11.3(A2) IC11.4(GND) IC12.5(GND) IC13.3(GND) IC14.1 IC15.1 IC16.4(P:V-) IC17.9(SGND) IC17.10(PGND) IC17.21(PRESB) IC17.PAD IC18.3(GND) IC19.3(GND) IC20.3(GND) IC21.3(GND) IC22.3(GND) IC23.3(GND) IC24.4(GND) IC24.5(A2) IC24.6(A1) IC25.3(GND) IC25.4(GND) IC25.8(AGND) IC25.19(PGND) IC25.24(PGND) IC25.EP IC26.1 IC27.1 IC28.1 IC29.4(GND) IC29.8(TESTL) IC29.9(TESTBI/GPIO/XT) IC29.11(GND) IC29.17(GPIO) IC29.18(GND) IC29.20(/PIRQ) IC29.21(ATEST) IC29.23(ATEST) IC29.25(GND) IC29.26(ATEST) J1.2(GND1) J1.3(GND2) J1.7(GND3) J1.21(GND4) J1.36(GND5) J2.C5(C5/GND) J5.1 J6.3 J8.4 J9.7 J9.8 J10.3 J12.4_GND(GND) J12.SH1(GND_SH1) J12.SH2(GND_SH2) J13.1 J14.1 J15.7 J15.8 J16.4 J17.3 J18.1 J19.1 J20.1 J21.7 J21.8 J22.4 L12.1 PCB1.1 PCB1.2 PCB1.3 PCB1.4 PCB3.1 Q9.1(-A:S) Q9.4(-B:S) Q10.1(-A:S) Q10.4(-B:S) R2.2 R8.1 R9.1 R10.2 R12.1 R13.2 R15.1 R17.2 R19.2 R21.2 R31.2 R40.1 R41.2 R43.1 R44.2 R46.1 R48.1 R56.1 R57.1 R63.2 R70.1 R74.2 R83.1 R84.1 R85.1 R88.1 R89.1 R96.2 R99.2
DGND-F [HV]: D3.A D4.A J3.2 J3.7 J3.8 J4.2 J4.7 J4.8 L12.2
DIN_SM: IC1.60(TDI/CTED9/RA4) IC17.27(DIN) O40.P$1(TP) T20.P$1(TP)
DOUT_SM: IC1.79(RPD12/PMD12/RD12) IC17.28(DOUT) O27.P$1(TP) T19.P$1(TP)
EN-UTRASONIC: IC1.81(RPD4/PMWR/RD4) IC27.2 J16.1 O22.P$1(TP) T23.P$1(TP)
GAIN1-AUDIO: IC1.93(PMD0/RE0) IC25.5(GAIN0) O9.P$1(TP) R9.2 T46.P$1(TP)
GAIN2-AUDIO: IC1.92(TRD3/CTED8/RA7) IC25.6(GAIN1) O12.P$1(TP) R8.2 T35.P$1(TP)
GATE-Q3: C33.2 Q3.3(G) Q4.6(-A:D) R42.2
GATE-Q5: C34.2 Q4.3(-B:D) Q5.3(G) R45.2
GATE-Q7: C32.2 Q6.6(-A:D) Q7.3(G) R11.2
GATE-Q8: C37.2 Q6.3(-B:D) Q8.3(G) R14.2
GPIO1: IC1.32(AN8/RPB8/CTED10/RB8) O59.P$1(TP) R86.1 T49.P$1(TP)
GPIO1_: J1.13(GPIO98) R112.2
GPIO2: IC1.33(AN9/RPB9/CTED4/RB9) O60.P$1(TP) R87.1 T50.P$1(TP)
GPIO2_: J1.15(GPIO103) R113.2
I2C-SCL-TOUCH: IC29.2(SM_CLK) J1.6(I2C-SCL) J6.2
I2C-SDA-TOUCH: IC29.1(SM_DAT) J1.5(I2C-SDA) J6.1
ICB-ON: IC1.91(TRCLK/RA6) O13.P$1(TP) Q6.2(-A:G) R10.1 R16.2 T2.P$1(TP)
ILLUMINATE1: IC1.99(RPE3/PMD3/RE3) O8.P$1(TP) R116.1 T29.P$1(TP)
ILLUMINATE2: IC1.3(AN22/RPE5/PMD5/RE5) O1.P$1(TP) R119.1 T30.P$1(TP)
LAN-CTL: IC12.2(/RE) IC12.3(DE) IC21.4(Y)
LAN-CTL-ICB: IC21.1(A) J1.16(GPIO101) R57.2
LAN-CTL-PIC: IC1.84(PMD15/RD7) IC21.2(B) R56.2
LAN-RX: IC1.88(RPF1/PMD10/RF1) IC12.1(R) IC19.2(B) R72.2
LAN-RX-ICB: IC19.4(Y) J1.31(RXD-B)
LAN-TX: IC2.4(Y) IC12.4(D)
LAN-TX-ICB: J1.32(TXD-B) R54.1 R122.1
LAN-TX-PIC: IC1.87(RPF0/PMD11/RF0) IC2.1(A) R55.2
LED-PIC: IC1.1(RG15) R29.1 TP4.P$1(TP)
N$1: C4.1 IC17.11(C-)
N$2: C5.1 IC17.15(CPO)
N$3: C4.2 IC17.14(C+)
N$4: IC17.23(-UNDERV) R1.1
N$5: IC5.4(OUT) IC18.1(A)
N$6: IC2.2(B) IC18.4(Y)
N$7: Q9.3(-B:D) R60.1
N$8: IC3.4(GP2/T0CK) R61.1
N$10: C43.2 Q1.2(-A:G) R50.1 R51.2
N$11: IC25.14(AVCC) R5.2
N$13: IC11.7(WP) R18.2 TP1.P$1(TP)
N$14: D5.A R29.2
N$16: Q4.1(-A:S) R40.2
N$17: Q4.4(-B:S) R43.2
N$18: C39.1 IC14.4 R30.1
N$20: F1.1 J19.2
N$21: J20.2 Q7.1(D) Q7.2(D) Q7.5(D) Q7.6(D)
N$23: Q6.1(-A:S) R12.2
N$24: L13.2 R92.1
N$25: IC17.22(NC/-NO) R2.1
N$26: Q6.4(-B:S) R15.2
N$27: IC6.1(HTH) R46.2 R47.1
N$28: IC6.3(LTH) R33.1 R47.2
N$29: Q1.1(-A:S) R52.1
N$30: L1.2 Q8.1(D) Q8.2(D) Q8.5(D) Q8.6(D)
N$31: R62.2 R63.1 R64.2
N$32: C61.1 IC1.64(CLKO/RC15/OSC2) X1.1
N$33: C80.2 IC5.2(IN) R121.1
N$34 [HV]: C22.1 C23.1 C84.1 IC8.4(VIN) JP1.3 L2.2 R22.1
N$35: C45.1 IC22.2(IN) R64.1
N$36: Q2.1(-A:S) R106.1
N$37: IC4.3(OUT) R36.1
N$38: R73.2 R74.1 R76.2
N$39: C60.1 IC1.63(CLKI/RC12/OSC1) X1.3
N$40 [HV]: C32.1 IC4.4(VIN-) Q7.4(S) R11.1 R16.1 R35.1 R37.1
N$41: R66.1 R67.1 R68.2 R69.2
N$42: C46.1 IC23.2(IN) R76.1
N$43: C6.1 IC3.5(VDD) J10.2 R3.2
N$44: C58.1 C59.1 IC13.1(VIN) R93.2
N$45: Q10.6(-A:D) R68.1 R69.1
N$46: J7.2 R66.2 R67.2
N$47: J7.3 R62.1
N$48: R94.2 R95.1
N$49: C62.1 IC16.3(A:+IN) R95.2 R96.1
N$50: C26.2 IC8.6(FB) R19.1 R20.2
N$51: C24.2 R77.2
N$52 [HV]: C25.1 D7.K IC8.3(SW) L9.1
N$53: IC8.8(RT) R17.1
N$54: IC8.7(SS) R77.1
N$55 [HV]: IC8.5(EN) JP1.2 R22.2
N$56: Q2.4(-B:S) R105.1
N$57 [HV]: C25.2 IC8.2(BOOST)
N$58 [HV]: C89.+ C90.1 JP2.2
N$59 [HV]: L7.1 R108.1
N$60: R97.2 R98.1
N$61: Q10.3(-B:D) R80.1 R81.1
N$62: R23.1 R49.2
N$63: C63.1 IC16.5(B:+IN) R98.2 R99.1
N$64: IC16.6(B:-IN) IC16.7(B:OUT) R100.2
N$65: C67.1 IC16.8(P:V+) R103.1
N$66: IC16.1(A:OUT) IC16.2(A:-IN) R101.2
N$67: C69.2 Q2.5(-B:G) R24.1 R65.2
N$68: IC10.3(OUT) R102.1
N$69: C98.1 IC19.5(VCC) IC20.5(VCC) R132.2
N$70: C40.1 R90.1 R91.1
N$71: J8.3 R73.1
N$72: C82.2 Q1.5(-B:G) R125.1 R126.2
N$73: C70.2 Q2.2(-A:G) R75.1 R82.2
N$74 [HV]: L8.1 R109.1
N$75: Q1.4(-B:S) R127.1
N$80: J8.2 R78.2 R79.2
N$81: C89.- C90.2 R78.1 R79.1 R80.2 R81.2
N$83: J1.34(RXD-C) R123.1
N$85 [HV]: C85.1 D6.A IC15.4 J12.1_+5V(+5V) R128.1
N$87 [HV]: JP1.1 R21.1
N$94: C73.2 IC1.47(RPD14/RD14) R107.2
N$101: J1.35(TXD-C) R124.2
N$102: C73.1 IC1.44(AN15/RPB15/PMA0/CTED6//RB15) R104.2 R107.1
N$103: C74.2 IC1.34(CVREFOUT/AN10/RPB10/PMA13/CTED11/RB10) R111.2
N$104: C74.1 IC1.35(AN11/PMA12/RB11) R110.2 R111.1
N$109: C71.1 R87.2 R89.2 R113.1
N$110: C68.1 R86.2 R88.2 R112.1
N$114: C2.1 C3.1 C77.1 IC17.1(DVCC) IC17.12(SVBAT) IC17.13(PVBAT) R1.2 R114.2
N$115: Q10.2(-A:G) R70.2 R116.2
N$116: C79.1 IC22.5(VCC) IC23.5(VCC) R117.1
N$117: Q10.5(-B:G) R83.2 R119.2
N$118: IC18.2(B) R122.2
OUT+3.3V [GND]: C26.1 C30.1 C31.+ D2.+(C) IC8.1(BD) L9.2 R20.1 R129.2
OUTN: C14.1 IC25.23(OUTN) IC25.25(OUTN) L16.2
OUTP: C13.2 IC25.18(OUTP) IC25.20(OUTP) L15.2
PGC: IC1.24(PGEC1/AN1/RPB1/CTED12/RB1) J17.5
PGC2-/BTN2: IC3.3(GP1/PGC) J10.5 R71.1
PGD: IC1.25(PGED1/AN0/RPB0/RB0) J17.4
PGD2-/BTN1: IC3.1(GP0/PGD) J10.4 R120.1
PIC-RXD: IC1.6(RPC1/RC1) O2.P$1(TP) R124.1 T26.P$1(TP)
PIC-TX: IC1.9(RPC4/CTED7/RC4) O5.P$1(TP) R123.2 T28.P$1(TP)
POWER-GOOD: IC1.89(RPG1/PMD9/RG1) IC6.4(OUT) O15.P$1(TP) T45.P$1(TP)
REF2,5V: C57.1 IC1.29(VREF+/CVREF+/PMA6/RA10) IC13.2(VOUT)
REF-EN: IC1.28(VREF-/CVREF-/PMA7/RA9) R93.1
RESET-ICB: IC1.18(RPE8/RE8) O10.P$1(TP) Q9.2(-A:G) R85.2 T61.P$1(TP)
SCL1-EEPROM: IC1.66(SCL1/RPA14/RA14) IC7.6(SCL) IC11.6(SCL) IC24.2(SCL) R26.2
SCL2: IC1.58(SCL2/RA2) IC28.2 J22.1 O28.P$1(TP) R130.2 T5.P$1(TP)
SCLK1: IC1.70(RPD10/SCK1/PMCS2/RD10) J5.5
SCLK2-SPI: IC1.10(AN16/C1IND/RPG6/SCK2/PMA5/RG6) IC9.6(C)
SCLK_SM: IC1.76(AN24/RPD1/RD1) IC17.26(SCLK) O35.P$1(TP) T18.P$1(TP)
SDA1-EEPROM: IC1.67(SDA1/RPA15/RA15) IC7.5(SDA) IC11.5(SDA) IC24.1(SDA) R27.2
SDA2: IC1.59(SDA2/RA3) IC28.3 J22.2 O19.P$1(TP) R131.2 T1.P$1(TP)
SDI1: IC1.50(RPF5/PMA8/RF5) J5.8 O21.P$1(TP) T9.P$1(TP)
SDI2-MISO: IC1.22(PGED3/AN3/C2INA/RPB3/RB3) IC9.2(Q)
SDO1: IC1.48(RPD15/RD15) J5.6 O58.P$1(TP) T8.P$1(TP)
SDO2-MOSI: IC1.20(AN5/C1INA/RPB5/RB5) IC9.5(D)
SIM-CLK: IC17.18(CLKB) J2.C3(CLK/C3)
SIM-IO: IC17.20(IOB) J2.C7(C7/DATA)
SIM-RST: IC17.19(RSTB) J2.C2(RST/C2)
SIM-VCC: IC17.17(VCCB) J2.C1(VCC/C1)
SM_ASYNC: IC1.49(RPF4/PMA9/RF4) IC17.31(ASYNC) O20.P$1(TP) T57.P$1(TP)
SM_C4A: IC17.4(C4A) J9.2 J15.2 J21.2
SM_C8A: IC17.3(C8A) J9.1 J15.1 J21.1
SM_CLK_A: IC17.7(CLKA) J9.4 J15.4 J21.4
SM_DATA: IC1.68(RPD8/RTCC/RD8) IC1.69(RPD9/RD9) IC17.29(DATA) O25.P$1(TP) O26.P$1(TP) T12.P$1(TP) T16.P$1(TP)
SM_DET_A: IC17.2(PRESA) J9.10 J15.10 J21.10
SM_IO_A: IC17.5(IOA) J9.3 J15.3 J21.3
SM_RST: IC1.42(AN13/RB13) IC17.30(RIN) O55.P$1(TP) T11.P$1(TP)
SM_RST_A: IC17.6(RSTA) J9.6 J15.6 J21.6
SM_SYNC: IC1.43(AN14/RPB14/PMA1/CTED5/RB14) IC17.32(SYNC) O53.P$1(TP) T10.P$1(TP)
SM_VCC_A: IC17.8(VCCA) J9.9 J15.9 J21.9
SPKRN: C16.1 J11.2 L16.1
SPKRP: C15.1 J11.1 L15.1
TXD-ULTRASONIC: IC1.7(RPC2/RC2) IC27.3 J16.2 O23.P$1(TP) T3.P$1(TP)
VBAT [HV]: C33.1 C37.1 IC10.4(VIN-) J7.1 J8.1 JP2.1 L2.1 Q3.4(S) Q8.4(S) R14.1 R33.2 R39.1 R42.1 R97.1
VBAT-LAN [HV]: D3.C J3.1 J3.3 J4.1 J4.3 L11.2
VBAT-LAN-F [HV]: C34.1 D6.K L11.1 Q3.1(D) Q3.2(D) Q3.5(D) Q3.6(D) Q5.4(S) R45.1 R94.1
VBAT-POJ [HV]: C29.1 C83.1 D1.C F1.2 IC4.5(VIN+) IC10.5(VIN+) R35.2 R37.2 R39.2
VBAT-SENSE: C64.1 IC1.26(PGEC2/AN6/RPB6/RB6) R100.1
VBAT-TO-LAN: IC1.52(RPF2/RF2) Q4.2(-A:G) R41.1 R59.1
VBAT-TO-LAN-ICB: J1.18(GPIO85) R59.2
VBATLAN-SENSE: C36.1 IC1.27(PGED2/AN7/RPB7/CTED3/RB7) R101.1
VBUS: IC1.54(VBUS) R128.2
VCAP: C53.1 C54.+ IC1.85(VCAP) R118.2
VCAP-SENSE: C76.1 IC1.77(AN25/RPD2/RD2) R118.1
VCC-AUDIO: C1.1 C7.1 C8.1 C9.1 C10.1 C17.1 C18.1 C72.1 IC25.15(PVCC) IC25.16(PVCC) IC25.27(PVCC) IC25.28(PVCC) L1.1 R4.1
VPS-ON: IC1.53(RPF8/RF8) Q4.5(-B:G) R44.1 R58.1
VPS-ON-ICB: J1.20(GPIO45) R58.2
VPS-PWR [HV]: D4.C J3.6 J4.6 L10.2
VPS-PWR-F: L10.1 Q5.1(D) Q5.2(D) Q5.5(D) Q5.6(D) R23.2
VPS-SENSE: C65.1 IC1.12(AN18/C2IND/RPG8/PMA3/RG8) IC20.2(B) R48.2 R49.1
VPS-SENSE-ICB: IC20.4(Y) J1.19(GPIO79)
WAKE-SW: IC1.72(RPD0/INT0/RD0) J14.5
Unconnected: IC1.8(RPC3/RC3) IC1.17(TMS/CTED1/RA0) IC1.40(RPF12/RF12) IC1.41(AN12/PMA11/RB12) IC1.51(RPF3/USBID/RF3) IC1.80(PMD13/RD13) IC1.98(AN20/PMD2/RE2) IC1.100(AN21/PMD4/RE4) IC8.9(PG) IC17.16(NC) IC24.3(OS) IC25.13(NC) IC29.5(NC) IC29.6(GPIO-EXPR-00) IC29.7(PP/GPIO/TWI_WUP) IC29.12(NC) IC29.13(NC) IC29.14(NC) IC29.15(NC) IC29.27(NC) IC29.28(NC) J1.8(SSP-SCLK) J1.9(SSP-FRM) J1.10(SSP-RXD) J1.11(SSP-TXD) J1.12(+5V) J1.22(AN-IN3) J1.23(AN-IN2) J1.24(AN-IN1) J1.25(AN-IN0) J1.26(AGND) J1.29(CTS-B) J1.30(RTS-B) J1.37(PWM_A) J1.40(PWM_D) J2.C4 J2.C6 J2.C8 J5.2 J5.3 J5.10 J6.7 J6.8 J6.9 J6.10 J9.5 J14.8 J15.5 J21.5 JP2.3 PCB2.1 PCB2.2 PCB2.3 PCB2.4

## Notes on the sheet
- HOTOVO:
- Opravit USB konektor na USB-B a prehodi D+D-
- konektory  RJ 90st 180st?
- teploni senzo doplnit ano/ne?
- detekce a mereni 3,3V ICB, mereni 3,3V, mereni VDDCORE
- na co pouzit to druhe mereni napeti? na +5V ICB? | TOUCH PANEL
- Petr chce Debugovaci konektor z ICB - musi byt na  UART-A
- Upravit prvni mereni proudu a prvni spinac  a zapojit aby spinal jak ICB tak ICBE
- Druhy vypinac + Druhe mereni proudu pro ICB a spinani z ICB a ICBE
- 2x tlacitko + 2xpodsviceni - vypinatelne
- Napajeci konektory 5mm | Chce se pouzit 4 clankovy LiFEPO nominal 12,8V (4x3.2) bezne nabijeni max. 14,8V (4x3.7V) pocatecni iniciacini napijeni 16,0 nebo 16,8 (4x 4,0 nebo 4.2V) vrcho je tedy stejny jako u Lion
- Transil P6SMB16A standoff 13.6V  breakdown 15.2-16.8V/1mA  max power 22.5V/27A - NELZE POUZIT s 4 clankovym LIFEPO
- Transil P6SMB20A standoff 17.1V  breakdown 19-21V/1mA  max power 27,7V/22A
- dle DSH A,B funguji v rozsahu +12V/-7V, RS486 terminator 110R, differ. imp 54R 50pF
- dle DSH maji A, B vstupni odpor 180k do zdroje 1,6V s impedanci 18k (delic 36k/36k)
- diferencialni odpor mezi A-B je tedy cca 400k to odpovídá změřeným 0,42V s 3x1M
- Napajeci konektory 3.5mm | dle mereni pri tomto zapojeni A,B na delic 1M-1M-1M je v klidu diferencni napeti 0,42V
- na A=2,01V na B=1,59V pri VCC=3,30V
- dle mereni spotreba 4,4mA - kdyz /RE=DE=0 je aktivni, nebudi linku a posloucha R=3,3V A>B R=0V A<B
- dle mereni spotreba 9,3mA - kdyz /RE=DE=1 je aktivni a budi linku A/B podle D
- 0p | spojeni /RE a DE je pekna prasarnicka dle DSH je jeden pull up 100k a druhy pull down 100k
- pri mereni zjistuji napeti 0,84V - oh shit nedefin 0.8-2.0V, 100k k GND 0,45V, 100k na +3,3V 2,32V
- DODELAT protikolizni hradlovou logiku | spojeni /RE a DE ma impedanci cca 90k-150k -> pull down <20k, napeti je 0,84V a chova se to jako low ale je to nespolehlive!
- kdyz /RE=0 a B<A tak R=3.3V imp cca 30R,  kdyz /RE=1 tak R je Hiz je vhodne pull up
- jsou u J1 | dle mereni je D pullupovane cca 90-150k - neni nutny ext. pull up, kdyz D=1 tak B=0V a A=3,3V
- RXB,TXB/RXC,RXD pripojit na RS485 a na PIC32 nezalezi na ktery | 8p | O
- Napajeni ICB IRIS
- LAN-TX budi hradlo
  proto tu neni pullup 47k
- nejaky 1 GPIO (out) pouzit na CTL RS485 - ktery? | I
- LAN-CTL budi hradlo
  proto tu neni pulldown 10k
- nejake 2 GPIO (out) pouzit zapinani napajeni LAN a VPS
- nejaky 1 GPIO (in) pouzit jako informaci VPS-SENSE
- POWER ICB
  2A max.
- <-6uA/12V
- Mozna pouzit 2 GPIO(in) pro prenos info o tlacitkach ??? | 2p+2p+3p
- R16 zajistuje ze
  pokud PIC32 nejede
  tak ICB je napajeno
  chtel to Petr
- NEZAPOJENO !!!!
- pozor na J1 je vse pull downovnone procesorem  krome i2c
- vsechny piny (i PWM, i SPI, i CTS RTS) muzou byt GPIO krome AN | <-1uA
- stabilization <0,1% 0,8ms
- tau=0,11ms
- tau=1ms | tau=1us
- <-8,7uA/2,6V | Ugs=0,64V
- CURR-ICB dat na AN+RP
- alternativni napajeni sem
  z USB z +5V pres diodu
- 2,5V@1A (0,025R) | VBAT nom = 12.8V
- INT2
- Petr chce aby si procesory vzajemne 
  povidali i jinak nez RX/TX
- ratio 1:100   supply curr 1uA  out imp 10k | kond u PICA
- VPS by mohl zapinat i ICB
  otazka jestli to stoji za to
- Napajeni LAN musi ridit vyhradne PIC32
  protoze jen on vidi na proud a napeti
- POWER IN
  12V (8-17V)
  3A max.
- Cuchat VPS by mely oba procesory
  bezpodminecne to neni
  ale musi byt vyreseno bezkolizne
  problem je ze zapinani RS485 je power uloha
  a ty by mel delat vyhradne PIC32
- <-4,3-6,5uA/13V
- VPS-SENSE dat na AN+RP
- <-1uA
- <-2.5uA
- <-2.5uA
- tau=0,56ms | INT3
- stabilization <0,1% 0,8ms | tau=0,5ms  1n/0,5M
- kond u PICA
- tau=0,11ms
- <-3.3uA/3.3V
- <-8,7uA/2,6V | Ugs=0,64V
- <-3.3uA/3.3V
- <-8,7uA/2,6V
- CURR-SENSE dat na AN+RP
- 2,5V@1A (0,025R)
- INT1
- merici krok na ADC 25,0mV
- musi byt pohromade
- rozsah do 25,6V ->2,50V
- ratio 1:100   supply curr 1uA  out imp 10k | kond u PICA
- musi byt pohromade
- stabilization  <0,1% 5ms
- kond u PICA
- tau=0,22ms
- kond u PICA
- 1M/100nF/300k:
- 1p | tONtime=50ms rise time 20ms  max.dU/dt=0,5V/1ms max. curr. 0,5A @ 1000uF
- tOFFtime=150ms  fall time 50ms
- pri REF = 2,5V je merici rozasah do 25,58V => 2,50V na ADin
- FDG6303N   IDS/UGS 1-10uA/0,6-0,7V ISD<0,2uA/0,55V 90pA/0V 2,1nA/0,23V 220nA/0,55V  8uA/0,66V
- delici pomer 1 : 0,09757 a mereny dilek 25,0mV (24,98mV)
- SSM6P49NU  IGS/UGS  9,5nA/3,5V  20nA/5V 0,2uA/10V
- BT ma 5 I/O, TX a RX nutne na RPxx I/O, WAKE a RTS na OUT, CON_LED je IN na RPxx | SSM6P49NU  IDS=0,1-1A/UGS=1,2-1,3V/UDS=3-15V
- zatez 10uF na desce | SSM6P49NU  RDSON=0,08/UGS=1,8V(max. by DSH 0,15)    RDSON=0,06/UGS=2,5V(max. by DSH 0,08)
- Petr chce BT z +3.3V | IDS 0,01->1A / UGS=1.2->1.3V
- SRAM,2xEEPROM,LATCHe 0,5uA
- IDS 150uA / UGS=0.68V
- tedy nema smysl vypinat
- spinani 100us pri 10uF+22R zatezi
- max. dU/dT=1V/30us na 10uF => 300mA
- Bluetooth modul | 5p | CRITICAL LAYOUT !!!   see page 22  DSH TPA3111D1
- extention | 5p
- Audio Amplifier
- 1x10W@8R Class-D Uin 8-26V
- eff 94% Vin=12V 10W@8R
- 1p | U3RX | gain select 20,26,32 or 36dB
- +3.3V/2 je jen budic LAN RS485 | U3TX | shutdown 400uA
- INTx | INT4
- 4p
- ???
- zatez 10uF na desce
- spinani 100us pri 10uF
- max. dU/dT=1V/30us na 10uF => 300mA
- IC12 RS485 odber cca 5mA
- ???
- NEDAT 5pinový???
- JEN VYPOCTY - NEOVERENO!
- utlum 100R 20uF  RC=2ms
- tlumivka 3.3uH je jen pro pocit
- starup 0V->3,25V(-0,05V) 10ms
- 60dB s 20uF udela az na 0,8Mhz
- 7dB@100Hz
- a vyznamnejsi nez 100R se stava az nad 10Mhz
- INT1 Current Sense ICBE+LAN >0.8A
  INT2 Current Sense ICB >1.6A
           LTC1955  DOUT
  INT3 PowerGood
  INT4 BT modul
  
  UX1  ICBE <-> ICB
  UX2  LAN
  UX3  BT module 
  UX4  Ultrasonic sensor, externi UART
  UX5  LTC1955
  
  OC1, OC2  LTC1955 SM_SYNC
  OC3  LTC1955 SM_ASYNC
  OC4 Iluminate2
  OC5 Iluminate1
  
  SPI1 Contactless Card Reader
  SPI2 Flash
  
  I2C1 EEPROM, temperature
  I2C2 externi I2C - light senzor
- 22dB@1kHz
- pokud R<3R pak 3uH a 20uF staci pri >500kBps | <-3.3uA/3.3V
- 42dB@10kHz
- PIC32 zapina audio
  protoeze se stara o power
  a ani neni dost pinu na 40pinaku
- R>=1R zachovat vzdy! | <-8,7uA/2,6V
- 62dB@100kHz
- ENABLE obycejny out
  napapovat na nejaky UART na RX (jen RX, TX se nepouzije)
  dodal zapínání P-FETEM jako např. 3.3V/1 a ovladat z PIC32
- Udaje o PSRR ADC PIC nejsou
- Melo by byt >60dB@100Hz >40dB@1kHz a >0dB@100kHz
- 20uF pri odberu 5mA udrzi 10us pokles napeti pod 1:1000 (60dB)
- 20uF s L=3,3uH 1R<R<3R 60dB pro 800kHz
- Na G5 MB a Kiosk je tato 
  flaska na SPI1
  tady je na SPI2 protoze je tak
  na ACB kde to tak musi byt
  protoze SPI1 je nepouzitelna
- FLASH SPI SO08(150mil) 32Mb
- 4,5mV | MB v5.91 M25P16-VMN6P - obsolete
- RC 10R 20uF = 200us overeno merenim
- MB v5.92  N25Q032A13ESC  obsolete
- 6.6.2017 found:
- 3p | AT25SF321-SSHD | loops as short as possible
- na I2C | MX25R3235FM1IH0
- IS25LQ032B-JNLE
- ULTRASONIC SENSOR
  ultrzvukove cidlo vzdalenosti/pritomnosti cloveka
  bude se zapinat kazdou sekundu na asi 50ms
  cidlo ma 7 signalu, ale jen 4 potrebujeme
  GND, napajeni, seriova TX data a Enable
- pripojit 
  do jacka 
  na ICB
- REPRO 8R/10W
- 2p
- 0,45mA
- AVDD max. +/-0.3V od VDD
- na UART
- PWM OC5
- added EMI choke
- PWM OC4
- I in ->
- 0.1uF->1uF
- U1RX
- U4RX
- added EMI choke
- CN,INT2
- V datshitu DS60001185F-page 318 je uvedeno,
  ze AN15-AN27 jsou na hovno....  pice...
  CURR-SENSE je na AN19
  asi by slo prohodit s /3.3V1PWRON
- U1TX
- 4p
- added 1000uF
- RESET PIC jako na MB
- INT3,AN18 | IC7 power consuption =  22uA + 19% I in
- 2x TLACITKO + POSVETLENI LED zapinatelne 2x z VBAT | 30sec zmacknutim BTNx se ma PIC32 vyresetovat
- efficiency 81% *  ( Iin -27uA) / I in
- U2RX
- AN19,INT1 | U2TX
- Power Consuption
- 1.6.2015 v5.9  pridat RC FILTR 1R/2x47uF  a DC vazba je az R84
- 50mA/100Mhz | otestovalo se to a zda se to dobre
- neni RP->
- <3,2V 
  >7,7V
- 4mA | 4mA ->
- 10mA | 5mA/10Mhz
- neni RP->
- oba PICAKY musi jet zaroven jinak si rvou velky produ do noh | TADY je tvrda propojka PROC?
- INT2
- 0,1mA/31kHz LPRC
- U4TX
- pokud mozno
- neobsazovat USB
- TP1 musi byt pristupny pri testovani desky
- INT2
- INTx
- AN2,INT2 | INT4
- WAKEUP
- tau=30ms
- <1,0V 
  >2,4V
- AN
- Vyzkouset funkci EN pri 6V a pokud nebude potreba
- CNx
- OC1,2 | tak R21 odstranit a spoji JP1 2-3
- AN6 | AN6
- JP1  1-2  IC8 startuje pri 5,8-6,0V a to hnusne - je to nanic, mala hyst pokmitava v 5,8-6,0V | 1p
- AN7 | U3TX
- JP1  2-3   IC8 startuje pry pri  4,3V (dle DSH) ale
- tlumivka do serie s 300R nema smysl
- U3RX
- musela by byt aspon 100uH aby se projevila na 100kHz | IC8 funguje uz pri 3,8V (zmereno) dava 3,2V
- nebo PWM? | utlum 300R 0,2uF  RC=0,6ms | na USB J12 musi byt 4,2V pro napajeni z USB
- starup 0V->2,7V 1ms | REF3025
- 1dB@100Hz | PSRR 65dB@100Hz | 0,22mA | IC1 (PIC) funguje od 2,2V (zmereno) | <-10uA@12Vin
- na ACB jina funkce
- 3dB@1kHz | PSRR 45dB@1kHz
- 11dB@10kHz | PSRR 25dB@10kHz
- 31dB@100kHz | PSRR 5dB@100kHz
- 66mV | U5TX
- 5p | 300R 0,2uF+ REF3025 30-40dB -> odfiltruje AC az +/-0.1V -> +/-1mV na 2.5V
- U5RX
- prechodovy dej po velke zmene odberu 0->5mA
- se zatezi 0,01-1uF dozni po max. 100us dle DSH | THRon=9.9V
- RC 300R 200nF cca 60us overeno merenim
- Pri napajeni z USB spojit na JP1  2-3 !!! | zapina pri 6V
- THRoff=7.5V
- prechodovy pri ADON,REFEN=0->1 cca 250us
- Iquesc=42uA | Z USB pres diodu step down sotva funguje | THR=1.0V
- tzn. pri odberu cca 0,22mA
- vlastni odber 40uA (zmereno)
- Contactless Card Reader (DockReader20)
  ATTENTION! crossover cable necessary!!
  connection 1-9 3-7 5-5 2-10 4-8 6-6
  as well as between G5 MB and RF TOP
- Doba ustaleni 2.5V je  250us (zmereno) se zatezi 0,22mA (ADC ON) | INT4
- VSOLAR na MB
     a na RFTOP
- <3,2V 
  >7,7V
- 4mA | 4mA -> | PWM OC5 | 1.19V
- na MB out  PIC_INT
  ktery neni na DockReaderu20
- 100mA
- SCLK1 neni mapovatelne
  a musi na RD10 byt
- na DockReader20 je pullup
  takze zde neni potreba
- 2p
- OC1,2
- VBAT na MB59x
  BATB na MB55-58
- 835kHz
- neobsazovat USB
- neobsazovat USB
- Na G5 MB a Kiosk je tento konektor na SPI2 
  a FLASH na SPI1, tady je to naopak
- tau=30ms
- <1,0V 
  >2,4V
- 2p
- CNx
- neobsazovat USB
- SDI1,2 SDO1,2
- OC3
- SDI1,2 SDO1,2 INT4
- Narvat do Library
- pokud mozno neobsazovat USB
- nebo PWM?
- odstranit tu pinovou kravinu
  udelat poradne SYM a PAC a DEV
- 10p
- C8
- C4
- C7
- C3
- C6
- C2
- C5
- SW | Poznamky 2xUSB:
- 1) Na PICovi vystupy D+/D- (RG2/RG3) a vstup VBUS a sprvane zapojit napajeni VUSB3V
- HOPT+SCHULER | C1 | 2) Prepinac 1USB na 2USB TS3USB221, je udelany ACB.lbr, 1-2 vystupu: volba kanalu, prip OE USB
- 3) 2x ESD ochrana TPD2E001, pouzit na LAN-RS485, pouzdro jako SR3.3 semtech.lbr
- SW | INT2  sdileni s CURR-ICB teoreticky staci na CNx (vsechny piny PIC jsou CNx) | 4) 2x konektor USB udelan v ACB.lbr a na nej je potřeba 2x 5V/0,5A
- 5) Zdroj 5V/0.5A bud druhy LT3971EMSE +5V z VBAT zapinatelny (1 vystup)
- nebo zde pouzity co dela 3.3V zmenit na 5V a za nej lin.stab na 3.3V TLV73333 3.3V/0.3A
- a pripadne tento 5V udelat prepinatelny na 3,6V kdyz se nepouziva USB, aby se zvysila ucinnost (2vystupy)
- eventulne by slo prepina na 3,3V a lin stab vyblokovavat coz je nebezpecne (3vystupy) a nema moc smysl
- Ještě je otázka jestli by TLV73333 s maximem 0,3A stačilo na všechno na 3,3V (PIC 50mA kamera? VPS? RS485 10-30mA)
- 6) 2x zapinač napajení tzn. 2x P-FET ovladany z PICa - 2 vystupy
- Pro potřeby USB zabrat vyhradit a neobsadit RG2,RG3, VBUS
- Pro potřeby ovladani max. 6 vystupu, EN zdroje a OE USB prepinace lze spojit
- lze spojit volic kanalů a jeden gate tranzisdoru zapinajiho +5V (tim padem 4 vystupy)
- UART jednodratove - spojene TX a RX
  dat na kterekoliv dva RP a ty pak fyzicky spojit
  nebo jen na jednu nohu B14 B6 C2 D0 D1 D5 D8 E8 
  F13 F2 F3 G9 (UART5) nebo nohu B2 (UART4)
  na kterych lze zaraz namapovat oba TX a RX
- pridanim N-FETu se na signal volby kanalu by stento mohl ovlada P-fef +5V (jen 3vystupy)
- pro UART5 je mnoho moznosti jak 
  namapovat TX a RX (obe funkce) na jednu nohu,
  pro UART5  jsou tyto moznosti
  B14 B6 C2 D0 D1 D5 D8 E8 F13 F2 F3 G9 
  pro UART4 toto je mozne jen u B2
  pro UART1,2,3 nelze TX a RX dat na jednu nohu
- OC1,2(PWM)
- OC3(PWM)
- uz je zapojen na RD10
  a musi na RD10 byt
- sync taky na na OCx PWM
- hodiny, mohlo by to byt nejaka PWM,
  ale takto je to na MB
- C22 U>5.35V
- Opravdu SYNC dat na obycejny OUT? Ne na nejaky PWM (CNx)?
  Petr rika ze vlastne toto vubec napouziva
- async na OCx PWM
- nedat 10u?

## Library data of the parts
C1 C11 C19 C22 C23 C29 C30 C72 = DISCRETE:C-1206: Capacitor 1206
C2-C6 C9 C10 C12-C18 C20 C21 C24-C28 C32-C53 C55 C57-C71 C73-C80 C82 C85 C87 C88 C90-C98 = DISCRETE:C-0603
C7 C8 C83 C84 = SMD-ELYT:CAP-ELEC-SMD
C31 C81 C89 = SmdDisc:CT
C54 C56 C86 = DISCRETE:CT-1206
D1 D3 D4 = Littelfuse:P6SMB: P6SMB20A TVS Unidirectional 17.1V 1uA, 19.0-21.0V@1mA breakdown, 27.7V@22A P6SMB16A TVS Unidirectional 13.6V 1uA, 15.2-16.8V@1mA breakdown, 22.5V@27A
D2 = st-microelectronics-AOM:SMLVT3V3: TVS 600W 4.1 Breakdown
D5 = DISCRETE:LED-0805
D6 D7 = SmdDisc:DS: Diody schotki: 1) BAT48 MELF1406 signalova 40V 0,3V/10mA 0,5V/0,2A 30pF,10pF/5V 3uA/50°C 2) SS14 SMA power 40V 0,2V/10mA 0,4V/1A 300pF,60pF/20V 200uA/75°C
F1 = ArdDisp:POJISTKA: Pojistka 1) klasicka 5x20 ve vyvodovem pouzdru KS20SW 2) SMD 2410 (6x2,6mm) v pouzdru Littlefuse 0154
IC1 = ACB:PIC32MX470F512L: Jara 6.6.2017 sym, pac12x12 a pac 14x14 a zapojeni dev importovano z PIC32MX470F512L-80I_PF.bxl ...._PT.bxl
IC2 IC19 IC20 = ICBE:AHC1G08
IC3 = Microchip-AON:PIC10F200T: IC MCU Flash 256B of FLASH
IC4 IC10 = Touchstone-U:TSM9938: IC OPAMP CURRENT SENSE SOT23-5
IC5 IC22 IC23 = ICBE:AHC1G14
IC6 = ArdDisp:MIC841: Comparator intREF 1,24V 1,5-5,5V 1,5uA hyst-set-by-Rdiv (2x comp+RS), speed 15us/100mV 80us/10mV, types: MIC841Lxx push-pull if HTH>ref then low, MIC841Hxx push-pull if HTH>ref then high, MIC841Nxx open drain if HTH>ref then high imp
IC7 IC11 = Microchip-AON:24*: Serial EEPROM I2C
IC8 = ACB:LT3971: LT3971 38V, 1.2A, 2MHz Step-Down Regulator with 2.8μA Quiescent Current 5,6$ ext P-ch curr lim const on time http://cds.linear.com/docs/en/datasheet/3971fd.pdf Hořa 7.6.2017
IC9 = Micron-U:M25P16: 16Mbit low voltage SPI Flash
IC12 = TexasInstruments-AON:SN65HVD3082E: RS-422/485 TRX 1RX 1TX
IC13 = ACB:REF3025: REF3025 2.5V 0,2% 42uA Hora
IC14 IC15 IC26-IC28 = Semtech-AOM:SR05: IC TVS ARRAY 2-LINE 5V SOT-143
IC16 = Microchip-AON:MCP6042: OAMP 14kHz LowPower 0,6uA G=1 stable OutCapLoad 70p/50k 10n/10k RailToRail VSS+0,4V VDD-0,5V
IC17 = LinearTech-AON:LTC1955: Dual Smart Card interface with Serial control
IC18 IC21 = ICBE:AHC1G32
IC24 = NXP-AOM:LM75A: Digital temperature sensor and thermal watchdog - I2C, Pwr supp. 2.8 V to 5.5 V, Temp. range -55°C to +125°C, 11bit ADC, 3.5 µA in shutdown mode
IC25 = Brenneman:IC_TI_TPA3111D1: TI TPA3111D1 amp; MANUFACTURER: TI; MFR_PN: TPA3111D1PWP
IC29 = ICBE:AT97SC3205T: Hardware Asymmetric Crypto Engine; MANUFACTURER: Microchip; MFR_PN: AT97SC3205T-U3A1C20B
J1 = CON-pinHeader-AON:MA20-2-ICB-EXT
J2 = C&K_Components-U:CCM03-3504LFT: CONN SMART CARD FIXED 8PIN SMD
J3 J4 = ACB:RJ8-8
J5 = CON-Hirose-AON:DF11-10DP-2DSA: CONN HEADER 10POS 2MM PCB GOLD
J6 = CON-Hirose-AON:FH12A-10S-05SH
J7 J18 = Tyco-U:3-641215-3
J8 J16 J22 = Tyco-U:3-641215-4
J9 = con-hirose:FH12-10S-0.5S: 0.5mm Pitch Connectors For FPC/FFC Source: Data sheet <http://www.hirose.co.jp/cataloge_hp/e58605370.pdf>
J10 J17 = CON-pinHeader-AON:MA05-1
J11 J13 = Tyco-U:3-641215-2: header 2 pin 100mil spacing
J12 = ACB:USB: USB connector Type A Copy from TTSKK and redesign. Hořa 10.6.2017
J14 = CON-pinHeader-AON:MA08-1: Lita 8x1 Female 609-3589-ND (Digi-key) Male Jakýkoliv obyèejný 2,54mm konektor Hoøa 13.11.2016
J15 = CON-pinHeader-AON:MLW10G
J19 = ICBE:796644-2: Right angle 5mm terminal block
J20 = ICBE:284512-2: Right angle 3,5mm terminal block
J21 = Tyco-U:4-641215-0
JP1 JP2 = SmdDisc:JP3CLOSE12
L1 L15 L16 = Brenneman:L: Inductor, two pin; MANUFACTURER: Laird; MFR_PN: HI1812V101R-10
L2 L7 L8 L10-L13 = DISCRETE:L-1206
L9 = Sumida-UT:NR6028: NR6028, NRS6028 6x6x2,5mm, NR6045, NRS6045 6x6x4,5mm
O1 O2 O5 O8 O10 O11 O14-O16 O18-O22 O24-O28 O35 O53 O59 O60 T1 T3 T5 T6 T8-T10 T12 T16 T19 T21 T26 T28 T31 T34 T45 T48 T50 T57 T62 = TESTPAD:PIC-RPX: Docasna soucastka na smerovani wire k procesoru bez pripojeni k procesoru
O3 O4 O6 O7 O9 O12 O13 O17 O23 O29 O39 O40 O55 O58 T2 T4 T7 T11 T17 T18 T20 T23-T25 T29 T30 T35 T46 T47 T49 T61 = TESTPAD:PIC-OUT: Docasna soucastka na smerovani wire k procesoru bez pripojeni k procesoru
PCB1 = ICBE:PCB-ICBE
PCB2 = ICBE:PCB-ICB
PCB3 = BT_modul:BT_PCB
Q1 Q2 = Toshiba-AON:SSM6P49: MOSFET P-CH DUAL 30V UDFN6, 4A, 20V
Q3 Q5 Q7 Q8 = Fairchild-AON:FDC658AP: 1x P-MOSFET -30V 4A 0,05R@10V 3A 0,075R@4,5V Standard Level -30 V, -4.0A racionalne do 3A RDS(on) = 0.050 Ohm @ VGS = -10 V RDS(on) = 0.075 Ohm @ VGS = -4.5 V 6nC cca 1,2nF @5V VGS Ve stejném pouzdre stejně zapojeny je Si3421DV -30V, 8A racionalne 5A RDS(on) = 0.019 Ohm @ VGS = -10 V RDS(on) = 0.027 Ohm @ VGS = -4.5 V 25nC cca 5nF @5V VGS
Q4 Q6 Q9 Q10 = Fairchild-AON:FDG6303N: Dual N-channel digital FET 25V/0.5A 0.45Ohm
R1-R34 R36 R40-R51 R53-R104 R107-R126 R128-R132 = DISCRETE:R-0603
R35 R37-R39 R52 R105 R106 R127 = DISCRETE:R-0805
REF1 REF2 = technol:REF
TP1 TP4 = TESTPAD:ROUND_SMD: Generic round SMD testpad
X1 = TXC_Tech-U:XTAL

## Net classes
1 HV: clearance 0.3 mm to class 0